# Altium project SCH-29227.PrjPcb (part 1 of 2)
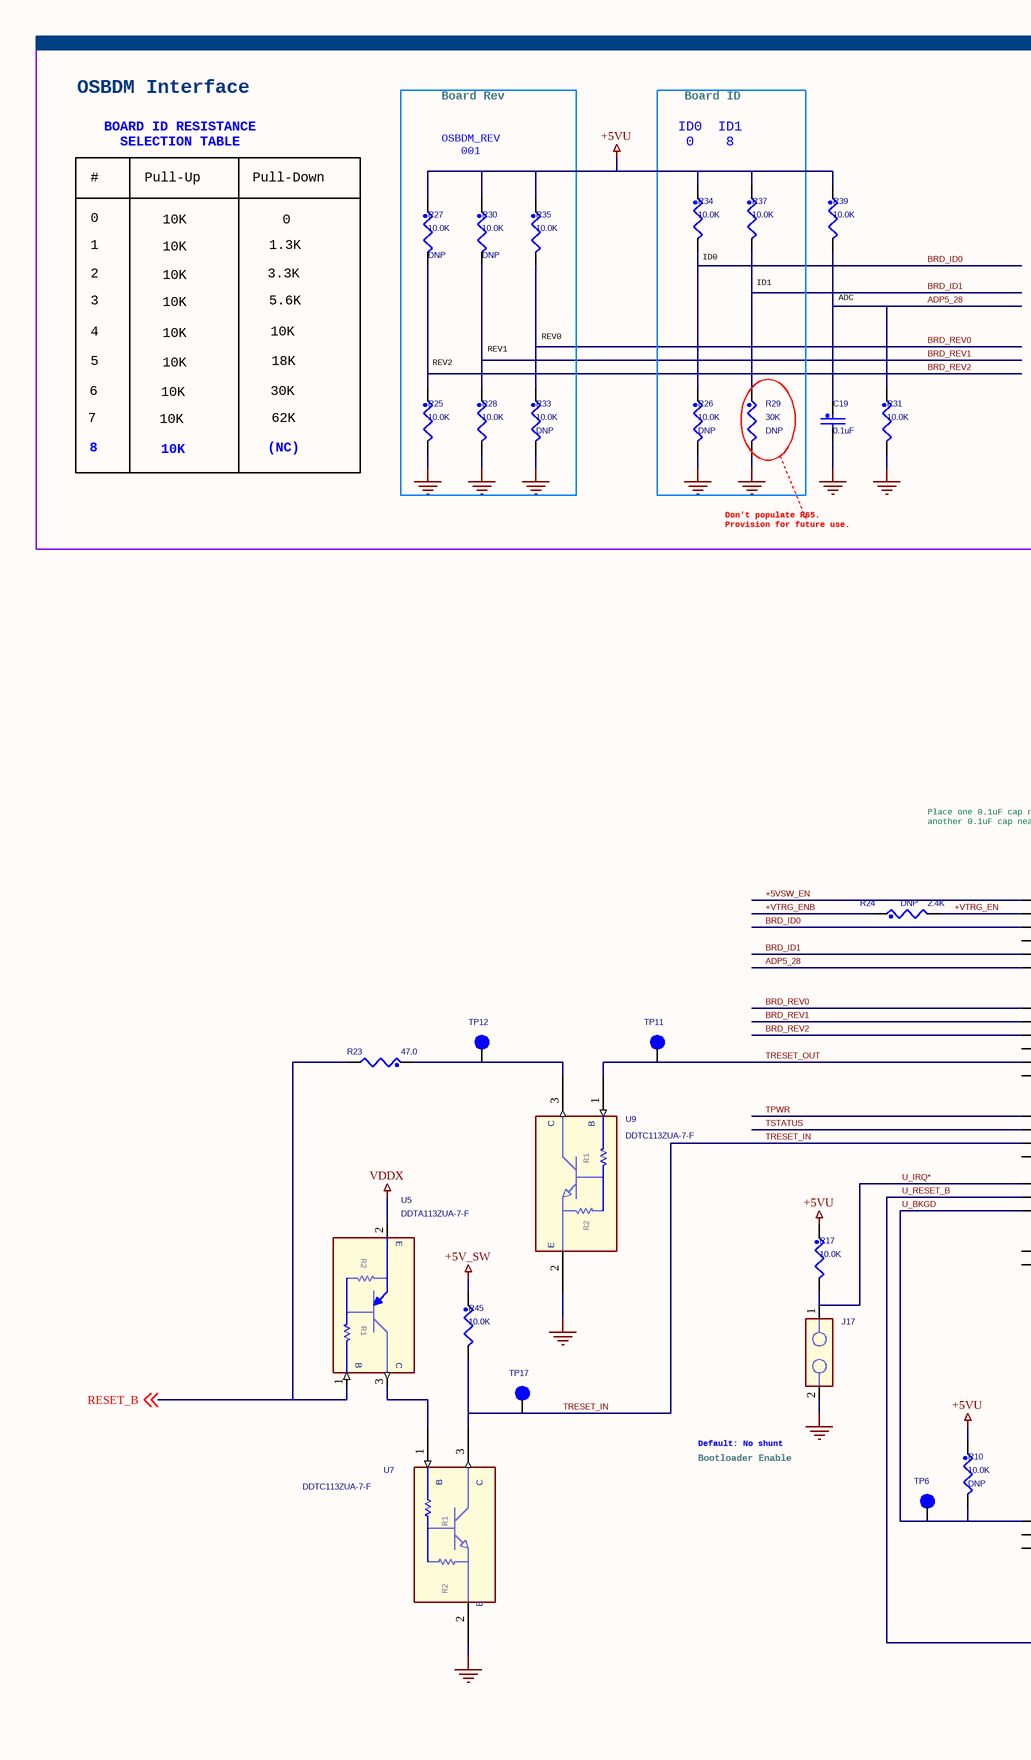
[diagram p0: 06.SchDoc, left]
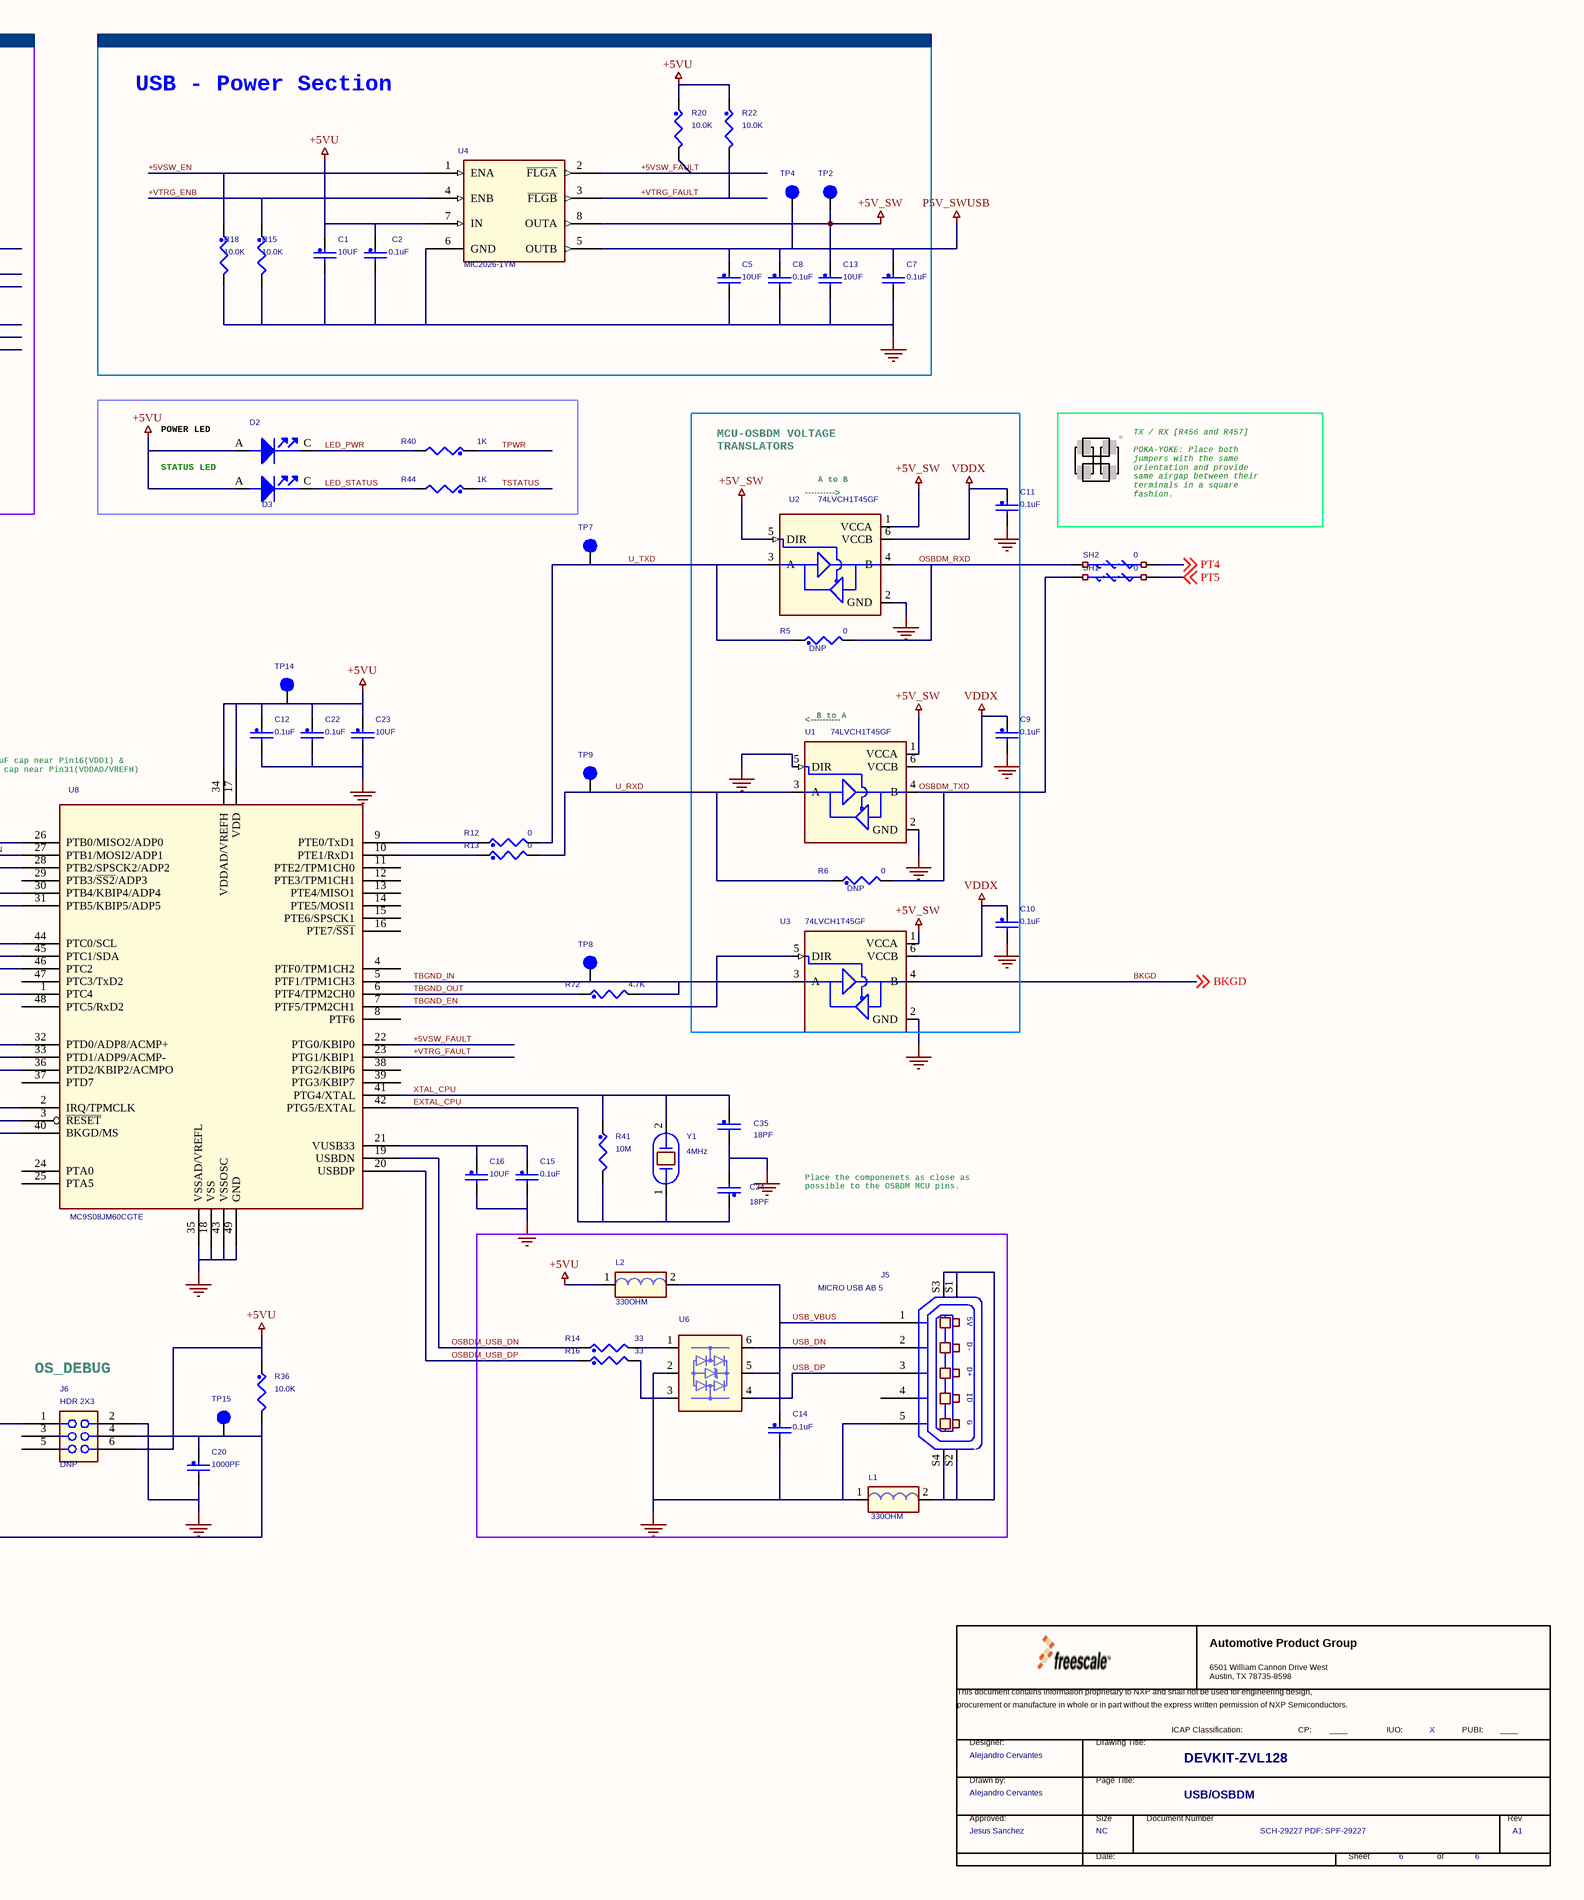
[diagram p1: 06.SchDoc, right]
6 sheets, 246 parts. Net scope: global (net labels, ports and power ports of the same name join across sheets).
Sheets:
  06.SchDoc
  05.SchDoc
  04.SchDoc
  03.SchDoc
  02.SchDoc
  01.SchDoc

## Sheet 06.SchDoc
size 513 x 386 mm

### Parts
(Parts that share a designator on the sheet are numbered #1, #2 ... from top to bottom, then left to right.)
*#1  FCP: ____  FIUO: X  DrawnBy: Alejandro Cervantes  Approver: Jesus Sanchez  PageTitle: USB/OSBDM  Page Count: 6  Page Size: NC  Title: DEVKIT-ZVL128  RevCode: A1  Doc: SCH-29227 PDF: SPF-29227  (hidden comment: TitleBlock_AMPG)  (graphical)
C1  10UF  [CC0805_OV]
C2  0.1uF  [CC0402_25]
C5  10UF  [CC0805_OV]
C7  0.1uF  [CC0402_25]
C8  0.1uF  [CC0402_25]
C9  0.1uF  [CC0402_25]
C10  0.1uF  [CC0402_25]
C11  0.1uF  [CC0402_25]
C12  0.1uF  [CC0402_25]
C13  10UF  [CC0805_OV]
C14  0.1uF  [CC0402_25]
C15  0.1uF  [CC0402_25]
C16  10UF  [CC0805_OV]
C19  0.1uF  [CC0402_25]
C20  1000PF  [CC0402_25]
C22  0.1uF  [CC0402_25]
C23  10UF  [CC0805_OV]
C24  18PF  [CC0402_25]
C35  18PF  [CC0402_25]
D2  LED_YEL  [LED_0603]  (value not drawn)
D3  LED_GREEN  [LED_0603]  (value not drawn)
J5  MICRO USB AB 5  [con5_microusb]
J6  HDR 2X3  ASSY_OPT: DNP  [HDR203]
J17  HDR 1X2 TH  [HDR102]  (value not drawn)
L1  330OHM  [IND_0805]
L2  330OHM  [IND_0805]
R5  0  ASSY_OPT: DNP  [RC0603_OV]
R6  0  ASSY_OPT: DNP  [RC0603_OV]
R10  10.0K  ASSY_OPT: DNP  [RC0402_25]
R12  0  [RC0603_OV]
R13  0  [RC0603_OV]
R14  33  [RC0603_OV]
R15  10.0K  [RC0402_25]
R16  33  [RC0603_OV]
R17  10.0K  [RC0402_25]
R18  10.0K  [RC0402_25]
R20  10.0K  [RC0402_25]
R22  10.0K  [RC0402_25]
R23  47.0  [RC0603_OV]
R24  2.4K  ASSY_OPT: DNP  [RC0603_OV]
R25  10.0K  [RC0402_25]
R26  10.0K  ASSY_OPT: DNP  [RC0402_25]
R27  10.0K  ASSY_OPT: DNP  [RC0402_25]
R28  10.0K  [RC0402_25]
R29  30K  ASSY_OPT: DNP  [RC0402_25]
R30  10.0K  ASSY_OPT: DNP  [RC0402_25]
R31  10.0K  [RC0402_25]
R33  10.0K  ASSY_OPT: DNP  [RC0402_25]
R34  10.0K  [RC0402_25]
R35  10.0K  [RC0402_25]
R36  10.0K  [RC0402_25]
R37  10.0K  [RC0402_25]
R39  10.0K  [RC0402_25]
R40  1K  [RC0603_OV]
R41  10M  [RC0402_25]
R44  1K  [RC0603_OV]
R45  10.0K  [RC0402_25]
R72  4.7K  [RC0402_25]
SH1  0  [SH0603]
SH2  0  [SH0603]
TP2  TPAD_028  [TPAD_028]  (value not drawn)
TP4  TPAD_028  [TPAD_028]  (value not drawn)
TP6  TPAD_028  [TPAD_028]  (value not drawn)
TP7  TPAD_028  [TPAD_028]  (value not drawn)
TP8  TPAD_028  [TPAD_028]  (value not drawn)
TP9  TPAD_028  [TPAD_028]  (value not drawn)
TP11  TPAD_028  [TPAD_028]  (value not drawn)
TP12  TPAD_028  [TPAD_028]  (value not drawn)
TP14  TPAD_028  [TPAD_028]  (value not drawn)
TP15  TPAD_028  [TPAD_028]  (value not drawn)
TP17  TPAD_028  [TPAD_028]  (value not drawn)
U1  74LVCH1T45GF  [sot891_6p_0p35_1p05x1p05]
U2  74LVCH1T45GF  [sot891_6p_0p35_1p05x1p05]
U3  74LVCH1T45GF  [sot891_6p_0p35_1p05x1p05]
U4  MIC2026-1YM  [SO8]
U5  DDTA113ZUA-7-F  [sc70_3]
U6  RClamp0502A.TCT  [SC-89]  (value not drawn)
U7  DDTC113ZUA-7-F  [sc70_3]
U8  MC9S08JM60CGTE  [qfn48_0p5_5p25x5p25_a]
U9  DDTC113ZUA-7-F  [sc70_3]
Y1  4MHz  [HC49SDLF]

### Blocks framed on the sheet
OSBDM Interface: C19 R31 R39
Board Rev: R25 R27 R28 R30 R33 R35
Board ID: R26 R29 R34 R37
USB - Power Section: C1 C2 C5 C7 C8 C13 R15 R18 R20 R22 TP2 TP4 U4

### Nets
+5V_SW: C13.1 R45.1 TP2.1(Pin1) U1.1(VCCA) U2.1(VCCA) U2.5(DIR) U3.1(VCCA) U4.8(OUTA)
+5VU: C1.1 C2.1 C12.1 C22.1 C23.1 D2.A(ANODE) D3.A(ANODE) J6.6(B3) L2.1 R10.1 R17.1 R20.1 R22.1 R27.1 R30.1 R34.1 R35.1 R36.1 R37.1 R39.1 TP14.1(Pin1) U4.7(IN) U8.17(VDD) U8.34(VDDAD/VREFH)
GND: C1.2 C2.2 C5.2 C7.2 C8.2 C9.2 C10.2 C11.2 C12.2 C13.2 C14.2 C15.2 C16.2 C19.2 C20.2 C22.2 C23.2 C24.2 C35.2 J5.5(P5) J6.2(B1) J17.2 L1.1 R15.2 R18.2 R25.2 R26.2 R28.2 R29.2 R31.2 R33.2 U1.2(GND) U1.5(DIR) U2.2(GND) U3.2(GND) U4.6(GND) U6.2(GND) U7.2(E) U8.18(VSS) U8.35(VSSAD/VREFL) U8.43(VSSOSC) U8.49(GND) U9.2(E)
P5V_SWUSB: C5.1 C7.1 C8.1 TP4.1(Pin1) U4.5(OUTB)
VDDX: C9.1 C10.1 C11.1 U1.6(VCCB) U2.6(VCCB) U3.6(VCCB) U5.2(E)
+5VSW_EN: R18.1 U4.1(ENA) U8.26(PTB0/MISO2/ADP0)
+5VSW_FAULT: R20.2 U4.2(~{FLGA}) U8.22(PTG0/KBIP0)
+VTRG_EN: R24.2 U8.27(PTB1/MOSI2/ADP1)
+VTRG_ENB: R15.1 R24.1 U4.4(ENB)
+VTRG_FAULT: R22.2 U4.3(~{FLGB}) U8.23(PTG1/KBIP1)
ADP5_28: C19.1 R31.1 R39.2 U8.31(PTB5/KBIP5/ADP5)
BKGD: U3.4(B) ; off-sheet BKGD
BRD_ID0: R26.1 R34.2 U8.28(PTB2/SPSCK2/ADP2)
BRD_ID1: R29.1 R37.2 U8.30(PTB4/KBIP4/ADP4)
BRD_REV0: R33.1 R35.2 U8.44(PTC0/SCL)
BRD_REV1: R28.1 R30.2 U8.45(PTC1/SDA)
BRD_REV2: R25.1 R27.2 U8.46(PTC2)
EXTAL_CPU: C24.1 R41.2 U8.42(PTG5/EXTAL) Y1.1
LED_PWR: D2.C(CATHODE) R40.2
LED_STATUS: D3.C(CATHODE) R44.2
OSBDM_RXD: R5.2 SH2.1 U2.4(B)
OSBDM_TXD: R6.2 SH1.1 U1.4(B)
OSBDM_USB_DN: R14.1 U8.19(USBDN)
OSBDM_USB_DP: R16.1 U8.20(USBDP)
PT4: SH2.2 ; off-sheet PT4
PT5: SH1.2 ; off-sheet PT5
RESET_B: R23.2 U5.1(B) ; off-sheet RESET_B
TBGND_EN: U3.5(DIR) U8.7(PTF5/TPM2CH1)
TBGND_IN: R72.2 TP8.1(Pin1) U3.3(A) U8.5(PTF1/TPM1CH3)
TBGND_OUT: R72.1 U8.6(PTF4/TPM2CH0)
TPWR: R40.1 U8.32(PTD0/ADP8/ACMP+)
TRESET_IN: R45.2 TP17.1(Pin1) U7.3(C) U8.36(PTD2/KBIP2/ACMPO)
TRESET_OUT: TP11.1(Pin1) U8.1(PTC4) U9.1(B)
TSTATUS: R44.1 U8.33(PTD1/ADP9/ACMP-)
U_BKGD: J6.1(A1) R10.2 TP6.1(Pin1) U8.40(BKGD/MS)
U_IRQ*: J17.1 R17.2 U8.2(IRQ/TPMCLK)
U_RESET_B: C20.1 J6.4(B2) R36.2 TP15.1(Pin1) U8.3(~{RESET})
U_RXD: R6.1 R13.2 TP9.1(Pin1) U1.3(A)
U_TXD: R5.1 R12.2 TP7.1(Pin1) U2.3(A)
USB_DN: J5.2(P2) U6.6(D+)
USB_DP: J5.3(P3) U6.4(D-)
USB_VBUS: C14.1 J5.1(P1) L2.2 U6.5(VCC)
XTAL_CPU: C35.1 R41.1 U8.41(PTG4/XTAL) Y1.2
NetC15_1: C15.1 C16.1 U8.21(VUSB33)
NetJ5_S1: J5.S1(SHLD1) J5.S2(SHLD2) J5.S3(SHLD3) J5.S4(SHLD4) L1.2
NetR12_1: R12.1 U8.9(PTE0/TxD1)
NetR13_1: R13.1 U8.10(PTE1/RxD1)
NetR14_2: R14.2 U6.1(D+_PC)
NetR16_2: R16.2 U6.3(D-_PC)
NetR23_1: R23.1 TP12.1(Pin1) U9.3(C)
NetU5_3: U5.3(C) U7.1(B)

Not connected (* = marked no-connect by the designer): J5 4(P4); J6 3(A2) 5(A3); U8 4(PTF0/TPM1CH2) 8(PTF6) 11(PTE2/TPM1CH0) 12(PTE3/TPM1CH1) 13(PTE4/MISO1) 14(PTE5/MOSI1) 15(PTE6/SPSCK1) 16(PTE7/~{SS1}) 24(PTA0) 25(PTA5) 29(PTB3/~{SS2}/ADP3) 37(PTD7) 38(PTG2/KBIP6) 39(PTG3/KBIP7) 47(PTC3/TxD2) 48(PTC5/RxD2)

### Notes on the sheet
- BOARD ID RESISTANCE
  SELECTION TABLE
- OSBDM_REV
  001
- ID0  ID1
  0    8
- #
- Pull-Up
- Pull-Down
- 1
- 2
- 0
- 10K
- 3.3K
- 1.3K
- (near R34) ID0
- 3
- 4
- 5.6K
- REV0
- (near R37) ID1
- ADC
- 6
- 5
- 30K
- 18K
- REV2
- REV1
- 7
- 8
- (NC)
- 62K
- POWER LED
- MCU-OSBDM VOLTAGE
  TRANSLATORS
- TX / RX [R456 and R457]
  POKA-YOKE: Place both
  jumpers with the same
  orientation and provide
  same airgap between their
  terminals in a square
  fashion.
- Don't populate R65.
  Provision for future use.
- STATUS LED
- (near U2) ---------->
- (near U2) A to B
- (near U8) Place one 0.1uF cap near Pin16(VDD1) &
  another 0.1uF cap near Pin31(VDDAD/VREFH)
- (near U1) <----------
- (near U1) B to A
- Place the componenets as close as
  possible to the OSBDM MCU pins.
- Default: No shunt
- Bootloader Enable
- OS_DEBUG
- (in symbol DDTA113ZCA_3P) R2; R1
- (in symbol DDTD122LC) R1; R2
- (in symbol TitleBlock_AMPG) Automotive Product Group; 6501 William Cannon Drive West / Austin, TX 78735-8598; This document contains information proprietary to NXP and shall not be used for engineering design,; procurement or manufacture in whole or in part without the express written permission of NXP Semiconductors.; ICAP Classification:; CP:; IUO:; PUBI:; Designer:; Drawing Title:; Drawn by:; Page Title:; Approved:; Size; Document Number; Rev; Date:; Sheet; of
- (in symbol USB_MINI_AB_RECEPTACLE) 5V; D-; D+; ID; G

### Library data of the parts
*#1 = TitleBlock_AMPG: OrgAddr2: Austin, TX 78735-8598; OrgAddr1: 6501 William Cannon Drive West; OrgName: Freescale Semiconductor; PUBI: ____; Designer: Alejandro Cervantes; Page Number: 6; Page Create Date: March  8, 1995
C1 C16 = CAP_NP: CAP CER 10UF 10V 10% X7R 0805; CLASS: DISCRETE; FPLIST: CC0805_OV,CC0805,0805_CC; CAD_APPROVED: Yes; MFG_PN01: GRM21BR71A106KE51L; MFG_NAME01: Murata; AGILE_PN: 150-78501; VOLTAGE: 10V; HEIGHT: 1.4MM; ROHS: Yes; Tolerance: 10%
C2 C7 C8 C15 C22 = CAP_NP: CAP CER 0.1uF 50V 10% X7R 0402; CLASS: DISCRETE; FPLIST: CC0402_25,CC0402_HD,0402_CC; CAD_APPROVED: Yes; MFG_PN01: GRM155R71H104KE14D; MFG_NAME01: MURATA; AGILE_PN: 150-79069; HEIGHT: 0.55MM; ROHS: Yes; Tolerance: 10%; TOL: 10%; VOLTAGE: 50V
C5 C13 C23 = CAP_NP: CAP CER 10UF 10V 10% X7R 0805; CLASS: DISCRETE; AGILE_PN: 150-78501; MFG_NAME01: Murata; MFG_PN01: GRM21BR71A106KE51L; CAD_APPROVED: Yes; FPLIST: CC0805_OV,CC0805,0805_CC; Tolerance: 10%; ROHS: Yes; HEIGHT: 1.4MM; VOLTAGE: 10V
C9-C12 C14 C19 = CAP_NP: CAP CER 0.1uF 50V 10% X7R 0402; CLASS: DISCRETE; AGILE_PN: 150-79069; MFG_NAME01: MURATA; MFG_PN01: GRM155R71H104KE14D; CAD_APPROVED: Yes; FPLIST: CC0402_25,CC0402_HD,0402_CC; VOLTAGE: 50V; Tolerance: 10%; ROHS: Yes; HEIGHT: 0.55MM
  C12 C14 C19: TOL: 10%
C20 = CAP_NP: CAP CER 1000PF 50V 10% X7R 0402; CLASS: DISCRETE; VOLTAGE: 50VDC; TOL: 5%; FPLIST: CC0402_25,CC0402_HD,0402_CC; CAD_APPROVED: Yes; MFG_PN01: 04025C102KAT2A; MFG_NAME01: AVX; Tolerance: +10%; AGILE_PN: 150-75271; HEIGHT: 0.635 MM; ROHS: Yes
C24 C35 = CAP_NP: CAP CER 18PF 50V 1% C0G 0402; CLASS: DISCRETE; FPLIST: CC0402_25,CC0402_HD,0402_CC; CAD_APPROVED: Yes; MFG_PN01: 04025A180FAT2A; MFG_NAME01: AVX; AGILE_PN: 150-76630; VOLTAGE: 50V; HEIGHT: 0.59MM; ROHS: Yes; Tolerance: 1%
D2 = LED: LED YEL SGL 25MA 0603; CLASS: IC; CAD_APPROVED: Yes; MFG_PN01: 598-8040-107F; MFG_NAME01: DIALIGHT; AGILE_PN: 370-76522; HEIGHT: 0.8MM; ROHS: Yes
D3 = LED: LED ULTRA-BRIGHT GREEN SMT 0603; CLASS: IC; AGILE_PN: 370-75077; MFG_NAME01: LITE ON; MFG_PN01: LTST-C190KGKT; CAD_APPROVED: YES; ROHS: Yes; HEIGHT: 0.8MM
J5 = USB_MINI_AB_RECEPTACLE: CON 1X5 USB_MICRO_AB_RECEPTACLE RA SMT 0.65MM SP 105H AU; CLASS: IO; AGILE_PN: 211-78722; MFG_NAME01: Molex; MFG_PN01: 47589-0001; CAD_APPROVED: Yes; ROHS: Yes; HEIGHT: 2.65MM
J6 = CONN_HDR_3X2: HDR 2X3 TH 100MIL CTR 335H AU 95L; CLASS: IO; CAD_APPROVED: Yes; MFG_PN01: TSW-103-07-S-D; MFG_NAME01: SAMTEC; AGILE_PN: 210-75698; PRIORITY_PN: 028-00560; VOLTAGE: 450-550VAC; HEIGHT: 8.5MM; ROHS: Yes
J17 = JUMPER_0: HDR 1X2 TH 100MIL SP 339H AU 98L; CLASS: IO; CAD_APPROVED: YES; MFG_PN01: TSW-102-07-G-S; MFG_NAME01: SAMTEC; AGILE_PN: 210-80468; PRIORITY_PN: 028-00556; HEIGHT: 8.71 MM; ROHS: Yes
L1 = BEAD: IND FER BEAD 330 OHM@100MHZ 1.5A 25% 0805; PART_TYPE: FERRITE\BEAD; CLASS: DISCRETE; PRIORITY_PN: 024-00202; CAD_APPROVED: Yes; MFG_PN01: BLM21PG331SN1D; MFG_NAME01: MURATA; AGILE_PN: 180-77691; HEIGHT: 1.05MM; ROHS: Yes; Tolerance: 25%; TOL: 25%
L2 = BEAD: IND FER BEAD 330 OHM@100MHZ 1.5A 25% 0805; PART_TYPE: FERRITE\BEAD; CLASS: DISCRETE; AGILE_PN: 180-77691; MFG_NAME01: MURATA; MFG_PN01: BLM21PG331SN1D; CAD_APPROVED: Yes; PRIORITY_PN: 024-00202; TOL: 25%; Tolerance: 25%; ROHS: Yes; HEIGHT: 1.05MM
R5 = RES: RES MF ZERO OHM 1/10W -- AEC-Q200 0603; CLASS: DISCRETE; AGILE_PN: 470-75407; Tolerance: 1%; MFG_NAME01: KOA SPEER; MFG_PN01: RK73Z1JTTD; CAD_APPROVED: Yes; FPLIST: RC0603_OV,RC0603,R603-X2,0603_CC; PRIORITY_PN: 006-00371; ROHS: Yes; VOLTAGE: 1/10W; HEIGHT: 0.6MM
R6 R12 R13 = RES: RES MF ZERO OHM 1/10W -- AEC-Q200 0603; CLASS: DISCRETE; PRIORITY_PN: 006-00371; AGILE_PN: 470-75407; Tolerance: 1%; MFG_NAME01: KOA SPEER; MFG_PN01: RK73Z1JTTD; CAD_APPROVED: Yes; FPLIST: RC0603_OV,RC0603,R603-X2,0603_CC; VOLTAGE: 1/10W; ROHS: Yes; HEIGHT: 0.6MM
R10 R17 R25-R28 R30 R31 R33-R37 R39 R45 = RES: RES MF 10.0K 1/16W 1% AEC-Q200 0402; CLASS: DISCRETE; AGILE_PN: 470-75416; MFG_NAME01: KOA SPEER; MFG_PN01: RK73H1ETTP1002F; CAD_APPROVED: Yes; FPLIST: RC0402_25,RC0402_HD,0402_CC; Tolerance: 1%; ROHS: Yes; HEIGHT: 0.4MM
R14 = RES: RES MF 33 OHM 1/10W 5% AEC-Q200 0603; CLASS: DISCRETE; FPLIST: RC0603_OV,RC0603,0603_CC; CAD_APPROVED: Yes; MFG_PN01: CRCW060333R0JNEA; MFG_NAME01: VISHAY INTERTECHNOLOGY; AGILE_PN: 470-75848; ROHS: Yes; Tolerance: 5%; TOL: 5%; HEIGHT: 0.55 MM
R15 R18 = RES: RES MF 10.0K 1/16W 1% AEC-Q200 0402; CLASS: DISCRETE; FPLIST: RC0402_25,RC0402_HD,0402_CC; CAD_APPROVED: Yes; MFG_PN01: RK73H1ETTP1002F; MFG_NAME01: KOA SPEER; AGILE_PN: 470-75416; HEIGHT: 0.4MM; ROHS: Yes; Tolerance: 1%
R16 = RES: RES MF 33 OHM 1/10W 5% AEC-Q200 0603; CLASS: DISCRETE; AGILE_PN: 470-75848; MFG_NAME01: VISHAY INTERTECHNOLOGY; MFG_PN01: CRCW060333R0JNEA; CAD_APPROVED: Yes; FPLIST: RC0603_OV,RC0603,0603_CC; HEIGHT: 0.55 MM; TOL: 5%; Tolerance: 5%; ROHS: Yes
R20 = RES: RES MF 10.0K 1/16W 1% AEC-Q200 0402; CLASS: DISCRETE; FPLIST: RC0402_25,RC0402_HD,0402_CC; CAD_APPROVED: Yes; ASSY_OPT: DNP; MFG_PN01: RK73H1ETTP1002F; MFG_NAME01: KOA SPEER; AGILE_PN: 470-75416; HEIGHT: 0.4MM; ROHS: Yes; Tolerance: 1%
R22 = RES: RES MF 10.0K 1/16W 1% AEC-Q200 0402; CLASS: DISCRETE; AGILE_PN: 470-75416; MFG_NAME01: KOA SPEER; MFG_PN01: RK73H1ETTP1002F; ASSY_OPT: DNP; CAD_APPROVED: Yes; FPLIST: RC0402_25,RC0402_HD,0402_CC; Tolerance: 1%; ROHS: Yes; HEIGHT: 0.4MM
R23 = RES: RES MF 47.0 OHM 1/10W 1% 0603; CLASS: DISCRETE; FPLIST: RC0603_OV,RC0603,0603_CC; CAD_APPROVED: Yes; MFG_PN01: RK73H1JTTD47R0F; MFG_NAME01: KOA SPEER; AGILE_PN: 470-75816; PRIORITY_PN: 006-00488; ROHS: Yes; Tolerance: 1%; TOL: 1%; HEIGHT: 0.55 MM
R24 = RES: RES MF 2.40K 1/10W 1% 0603; CLASS: DISCRETE; FPLIST: RC0603_OV,RC0603,0603_CC; CAD_APPROVED: Yes; MFG_PN01: RK73H1JTTD2401F; MFG_NAME01: KOA SPEER; AGILE_PN: 470-30476; PRIORITY_PN: 006-01136; ROHS: Yes; Tolerance: 1%; TOL: 1%; HEIGHT: 0.55 MM
R29 = RES: RES MF 30K  1/16W 1% 0402; CLASS: DISCRETE; FPLIST: RC0402_25,RC0402_HD,0402_CC; CAD_APPROVED: Yes; MFG_PN01: RK73H1ETTP3002F; MFG_NAME01: KOA SPEER; AGILE_PN: 470-30999; HEIGHT: 0.40 MM; ROHS: Yes; Tolerance: 1%
R40 = RES: RES MF 1.0K 1/10W 5% 0603; CLASS: DISCRETE; FPLIST: RC0603_OV,RC0603,0603_CC; CAD_APPROVED: YES; MFG_PN01: CR0603-10W-102JT; MFG_NAME01: VENKEL COMPANY; AGILE_PN: 470-75412; HEIGHT: 0.6MM; TOL: 5%; ROHS: Yes; Tolerance: 5%
R41 = RES: RES MF 10M  1/16W 1% 0402; CLASS: DISCRETE; FPLIST: RC0402_25,RC0402_HD,0402_CC; CAD_APPROVED: Yes; MFG_PN01: RK73H1ETTP1005F; MFG_NAME01: KOA SPEER; AGILE_PN: 470-31288; ROHS: Yes; Tolerance: 1%; HEIGHT: 0.40 MM
R44 = RES: RES MF 1.0K 1/10W 5% 0603; CLASS: DISCRETE; AGILE_PN: 470-75412; MFG_NAME01: VENKEL COMPANY; MFG_PN01: CR0603-10W-102JT; CAD_APPROVED: YES; FPLIST: RC0603_OV,RC0603,0603_CC; HEIGHT: 0.6MM; TOL: 5%; Tolerance: 5%; ROHS: Yes
R72 = RES: RES MF 4.7K 1/16W 5% 0402; CLASS: DISCRETE; FPLIST: RC0402_25,RC0402_HD,0402_CC; CAD_APPROVED: Yes; MFG_PN01: RK73B1ETTP472J; MFG_NAME01: KOA SPEER; AGILE_PN: 470-75626; HEIGHT: 0.41mm; ROHS: Yes; Tolerance: 5%
SH1 SH2 = RES_SHORT-2: ZERO OHM CUT TRACE 0603 PADS; NO PART TO ORDER; CLASS: DISCRETE; AGILE_PN: 470-80018; MFG_NAME01: LAYOUT ELEMENT ONLY; CAD_APPROVED: Yes; FPLIST: SH0603,SH0603_CC,SH0603-X2_PIN1TO2,SH0603-X2_PIN2TO3; MFG_PN01: LAYOUT ELEMENT ONLY; ROHS: Yes; HEIGHT: 0.1MM
TP2 TP4 = TestLoop: TEST POINT PAD 28MIL DIA SMT, NO PART TO ORDER; CLASS: IO; CAD_APPROVED: Yes; AGILE_PN: 211-79313; HEIGHT: 0.1 MM; ROHS: Yes; MFG_PN01: N/A; MFG_NAME01: N/A
TP6-TP9 TP11 TP12 TP14 TP15 TP17 = TestLoop: TEST POINT PAD 28MIL DIA SMT, NO PART TO ORDER; CLASS: IO; AGILE_PN: 211-79313; CAD_APPROVED: Yes; MFG_NAME01: N/A; MFG_PN01: N/A; ROHS: Yes; HEIGHT: 0.1 MM
U1 U2 = 74LVCH1T45_0: IC XCVR 1BIT 3-STATE DUAL 1.2-5.5V SOT891; AGILE_PN: 312-80895; MFG_NAME01: NXP Semiconductors; MFG_PN01: 74LVCH1T45GF,132; CAD_APPROVED: Yes; CLASS: IC; ROHS: Yes; HEIGHT: 0.5MM
U3 = 74LVCH1T45_0: IC XCVR 1BIT 3-STATE DUAL 1.2-5.5V SOT891; CAD_APPROVED: Yes; MFG_PN01: 74LVCH1T45GF,132; MFG_NAME01: NXP Semiconductors; AGILE_PN: 312-80895; CLASS: IC; HEIGHT: 0.5MM; ROHS: Yes
U4 = MIC2526_8P: IC LIN SW PWR ACTIVE HIGH DUAL 2.7V-5.5V 0.5A SOIC8; CAD_APPROVED: Yes; MFG_NAME01: MICREL; AGILE_PN: 312-75936; PRIORITY_PN: 051-MIC20261YM; VOLTAGE: 2.7-5.5V; CLASS: IC; HEIGHT: 1.73mm; ROHS: Yes; MFG_PN01: MIC2026-1YM
U5 = DDTA113ZCA_3P: TRAN PNP PRE-BIASED 100MA 50V SOT-323; CLASS: IC; CAD_APPROVED: Yes; MFG_NAME01: DIODES INC; AGILE_PN: 480-78942; HEIGHT: 1.1MM; ROHS: Yes; MFG_PN01: DDTA113ZUA-7-F
U6 = RClamp0502A_6P: IC TVS ARRAY LOW CAP 3A 5V SOT666; CAD_APPROVED: Yes; MFG_NAME01: SEMTECH CORP; AGILE_PN: 312-80272; CLASS: IC; HEIGHT: 0.6MM; ROHS: Yes; MFG_PN01: RClamp0502A.TCT
U7 U9 = DDTD122LC: TRAN NPN PRE-BIASED 100MA 50V SOT-323; CLASS: IC; AGILE_PN: 480-78940; MFG_NAME01: DIODES INC; CAD_APPROVED: Yes; MFG_PN01: DDTC113ZUA-7-F; ROHS: Yes; HEIGHT: 1.1MM
U8 = MC9S08JM60CGT_4: IC MCU 8BIT 48MHZ 60KB FLASH 2.7-5.5V QFN48; AGILE_PN: 312-78039; MFG_NAME01: FREESCALE SEMICONDUCTOR; CAD_APPROVED: Yes; CLASS: IC; MFG_PN01: MC9S08JM60CGTE; ROHS: Yes; HEIGHT: 1.00MM
Y1 = XTAL: XTAL 4MHZ -- 18PF 20PPM SMT; CLASS: IC; CAD_APPROVED: Yes; MFG_PN01: ABLS-4.000MHZ-B2-T; MFG_NAME01: ABRACON CORP; AGILE_PN: 230-77689; PRIORITY_PN: 048-00299; HEIGHT: 4.2MM; ROHS: Yes

## Sheet 05.SchDoc
size 386 x 246 mm
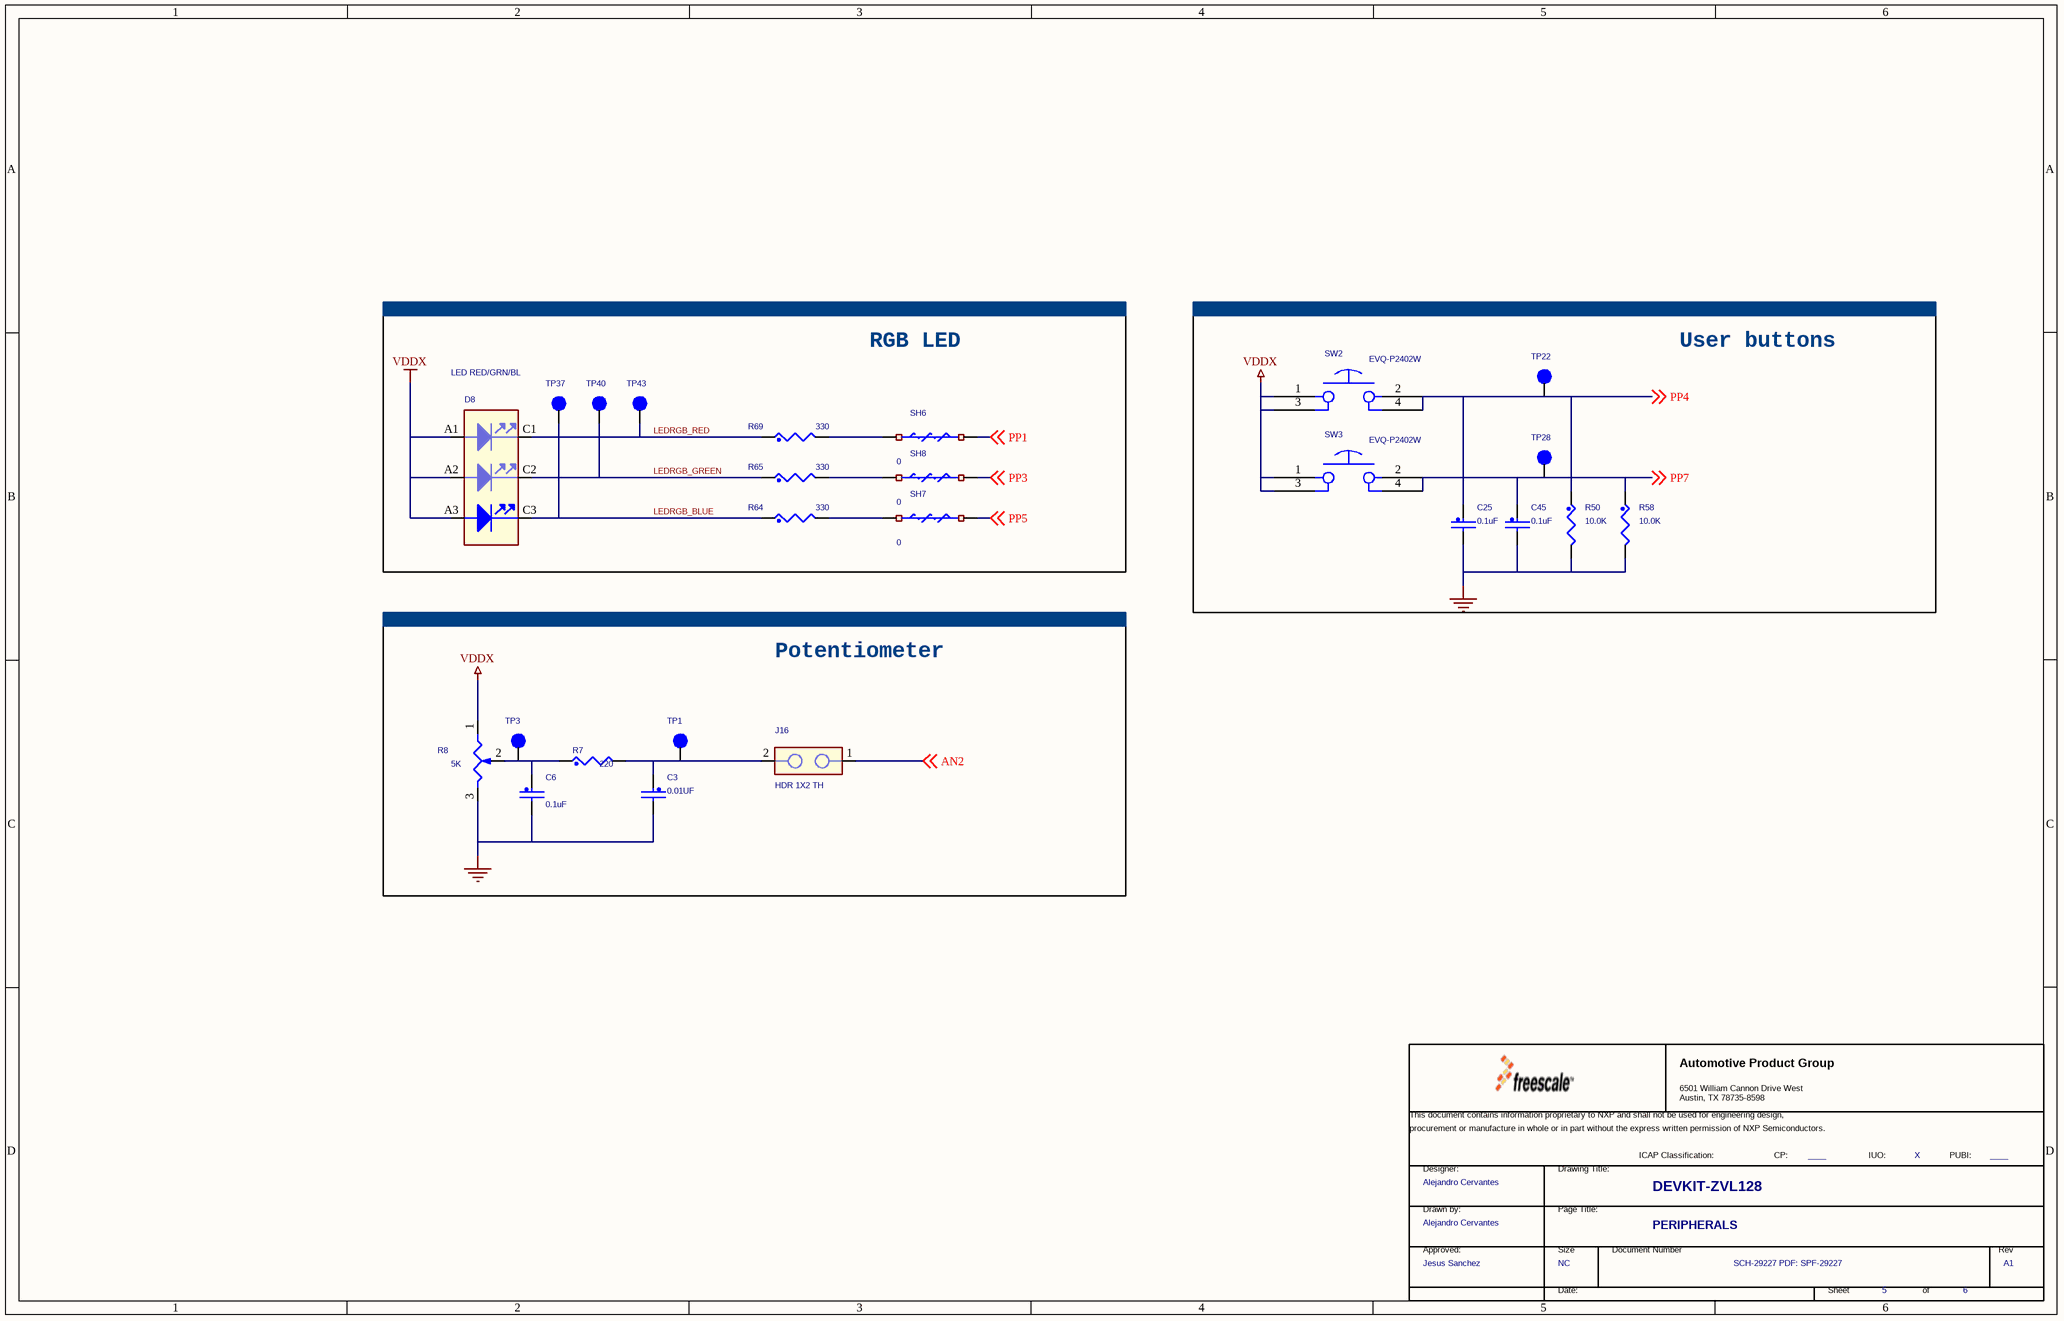
[diagram p2: 05.SchDoc]

### Parts
(Parts that share a designator on the sheet are numbered #1, #2 ... from top to bottom, then left to right.)
*#2  FCP: ____  FIUO: X  DrawnBy: Alejandro Cervantes  Approver: Jesus Sanchez  PageTitle: PERIPHERALS  Page Count: 6  Page Number: 5  Page Size: NC  Title: DEVKIT-ZVL128  RevCode: A1  Doc: SCH-29227 PDF: SPF-29227  (hidden comment: TitleBlock_AMPG)  (graphical)
C3  0.01UF  [CC0402_25]
C6  0.1uF  [CC0402_25]
C25  0.1uF  [CC0402_25]
C45  0.1uF  [CC0402_25]
D8  LED RED/GRN/BL  [led6_5x6mm]
J16  HDR 1X2 TH  [HDR102]
R7  220  [RC0603_OV]
R8  5K  [pot3_3352t]
R50  10.0K  [RC0402_25]
R58  10.0K  [RC0402_25]
R64  330  [RC0603_OV]
R65  330  [RC0603_OV]
R69  330  [RC0603_OV]
SH6  0  [SH0603]
SH7  0  [SH0603]
SH8  0  [SH0603]
SW2  EVQ-P2402W  [sw4_spst_4p8X3p6_2p5]
SW3  EVQ-P2402W  [sw4_spst_4p8X3p6_2p5]
TP1  TPAD_028  [TPAD_028]  (value not drawn)
TP3  TPAD_028  [TPAD_028]  (value not drawn)
TP22  TPAD_028  [TPAD_028]  (value not drawn)
TP28  TPAD_028  [TPAD_028]  (value not drawn)
TP37  TPAD_028  [TPAD_028]  (value not drawn)
TP40  TPAD_028  [TPAD_028]  (value not drawn)
TP43  TPAD_028  [TPAD_028]  (value not drawn)

### Blocks framed on the sheet
User buttons: C25 C45 R50 R58 SW2 SW3 TP22 TP28
RGB LED: D8 R64 R65 R69 SH6-SH8 TP37 TP40 TP43
Potentiometer: C3 C6 J16 R7 R8 TP1 TP3

### Nets
GND: C3.2 C6.2 C25.2 C45.2 R8.3(B) R50.2 R58.2
VDDX: D8.A1(ANODE1) D8.A2(ANODE2) D8.A3(ANODE3) R8.1(A) SW2.1 SW2.3 SW3.1 SW3.3
AN2: J16.1 ; off-sheet AN2
LEDRGB_BLUE: D8.C3(CATHODE3) R64.1 TP37.1(Pin1)
LEDRGB_GREEN: D8.C2(CATHODE2) R65.1 TP40.1(Pin1)
LEDRGB_RED: D8.C1(CATHODE1) R69.1 TP43.1(Pin1)
PP1: SH6.2 ; off-sheet PP1
PP3: SH8.2 ; off-sheet PP3
PP4: C25.1 R50.1 SW2.2 SW2.4 TP22.1(Pin1) ; off-sheet PP4
PP5: SH7.2 ; off-sheet PP5
PP7: C45.1 R58.1 SW3.2 SW3.4 TP28.1(Pin1) ; off-sheet PP7
NetC3_1: C3.1 J16.2 R7.2 TP1.1(Pin1)
NetC6_1: C6.1 R7.1 R8.2(WIPER) TP3.1(Pin1)
NetR64_2: R64.2 SH7.1
NetR65_2: R65.2 SH8.1
NetR69_2: R69.2 SH6.1

### Notes on the sheet
- (in symbol TitleBlock_AMPG) Automotive Product Group; 6501 William Cannon Drive West / Austin, TX 78735-8598; This document contains information proprietary to NXP and shall not be used for engineering design,; procurement or manufacture in whole or in part without the express written permission of NXP Semiconductors.; ICAP Classification:; CP:; IUO:; PUBI:; Designer:; Drawing Title:; Drawn by:; Page Title:; Approved:; Size; Document Number; Rev; Date:; Sheet; of

### Library data of the parts
*#2 = TitleBlock_AMPG: OrgName: Freescale Semiconductor; OrgAddr1: 6501 William Cannon Drive West; OrgAddr2: Austin, TX 78735-8598; PUBI: ____; Designer: Alejandro Cervantes; Page Create Date: March  8, 1995
C3 = CAP_NP: CAP CER 0.01UF 16V 20% X7R 0402; CLASS: DISCRETE; AGILE_PN: 150-30082; MFG_NAME01: AVX; MFG_PN01: 0402YC103MAT2A; CAD_APPROVED: Yes; FPLIST: CC0402_25,CC0402_HD,0402_CC; TOL: 20%; ROHS: Yes; HEIGHT: 0.56MM; Tolerance: 20%; VOLTAGE: 16V
C6 = CAP_NP: CAP CER 0.1uF 50V 10% X7R 0402; CLASS: DISCRETE; SIGNAL_MODEL: DEFAULT_CAPACITOR_100000pF_2_1; FPLIST: CC0402_25,CC0402_HD,0402_CC; CAD_APPROVED: Yes; MFG_PN01: GRM155R71H104KE14D; MFG_NAME01: MURATA; AGILE_PN: 150-79069; VOLTAGE: 50V; TOL: 10%; HEIGHT: 0.55MM; ROHS: Yes; Tolerance: 10%
C25 C45 = CAP_NP: CAP CER 0.1uF 50V 10% X7R 0402; CLASS: DISCRETE; FPLIST: CC0402_25,CC0402_HD,0402_CC; CAD_APPROVED: Yes; MFG_PN01: GRM155R71H104KE14D; MFG_NAME01: MURATA; AGILE_PN: 150-79069; PRIORITY_PN: 021-00169; SIGNAL_MODEL: DEFAULT_CAPACITOR_100000pF_2_1; HEIGHT: 0.55MM; ROHS: Yes; Tolerance: 10%; VOLTAGE: 50V
D8 = LED_TRI_COLOR: LED RED/GRN/BL SGL 3-IN-1 50mA SMT; CLASS: IC; CAD_APPROVED: Yes; MFG_PN01: CLP6C-FKB-CM1Q1H1BB7R3R3; MFG_NAME01: Cree, Inc; AGILE_PN: 370-76661; HEIGHT: 2.6 MM; ROHS: Yes
J16 = JUMPER_2_2mm: HDR 1X2 TH 100MIL SP 339H AU 98L; CLASS: IO; AGILE_PN: 210-80468; MFG_NAME01: SAMTEC; MFG_PN01: TSW-102-07-G-S; CAD_APPROVED: YES; FPLIST: HDR102,SH_HDR102_BOTTOM; ROHS: Yes; HEIGHT: 8.71 MM
R7 = RES: RES MF 220 OHM 1/10W 5% 0603; CLASS: DISCRETE; AGILE_PN: 470-30297; MFG_NAME01: KOA SPEER; MFG_PN01: RK73B1JTTD221J; CAD_APPROVED: Yes; FPLIST: RC0603_OV,RC0603,0603_CC; HEIGHT: 0.6MM; Tolerance: 5%; ROHS: Yes
R8 = POT: RES POT 5K 1/2W 20% TH; CLASS: DISCRETE; AGILE_PN: 470-80115; MFG_NAME01: BOURNS; MFG_PN01: 3352T-1-502LF; CAD_APPROVED: Yes; HEIGHT: 4.32 MM; TOL: 20%; Tolerance: 20%; ROHS: Yes
R50 R58 = RES: RES MF 10.0K 1/16W 1% AEC-Q200 0402; CLASS: DISCRETE; PRIORITY_PN: 006-00552; AGILE_PN: 470-75416; MFG_NAME01: KOA SPEER; MFG_PN01: RK73H1ETTP1002F; CAD_APPROVED: Yes; FPLIST: RC0402_25,RC0402_HD,0402_CC; SIGNAL_MODEL: DEFAULT_RESISTOR_10000OHM_2_1; Tolerance: 1%; ROHS: Yes; TOL: 1%; HEIGHT: 0.4MM
R64 R65 R69 = RES: RES MF 330 OHM 1/10W 5% 0603; CLASS: DISCRETE; AGILE_PN: 470-80926; MFG_NAME01: YAGEO AMERICA; MFG_PN01: RC0603JR-07330RL; CAD_APPROVED: Yes; FPLIST: RC0603_OV,RC0603,0603_CC; Tolerance: 5%; ROHS: Yes; HEIGHT: 0.55 MM
SH6 SH8 = RES_SHORT-2: ZERO OHM CUT TRACE 0603 PADS; NO PART TO ORDER; CLASS: DISCRETE; AGILE_PN: 470-80018; MFG_NAME01: LAYOUT ELEMENT ONLY; CAD_APPROVED: Yes; FPLIST: SH0603,SH0603_CC,SH0603-X2_PIN1TO2; MFG_PN01: LAYOUT ELEMENT ONLY; ROHS: Yes; HEIGHT: 0.1MM
SH7 = RES_SHORT-2: ZERO OHM CUT TRACE 0603 PADS; NO PART TO ORDER; CLASS: DISCRETE; FPLIST: SH0603,SH0603_CC,SH0603-X2_PIN1TO2; CAD_APPROVED: Yes; MFG_PN01: LAYOUT ELEMENT ONLY; AGILE_PN: 470-80018; HEIGHT: 0.1MM; ROHS: Yes; MFG_NAME01: LAYOUT ELEMENT ONLY
SW2 = EDGE_MOUNT_PB_SW_2: SW SPST PB NO 0.02A 15V SMT; CLASS: IC; CAD_APPROVED: Yes; MFG_NAME01: Panasonic; AGILE_PN: 510-77992; HEIGHT: 2.7 MM; ROHS: Yes; MFG_PN01: EVQ-P2402W
SW3 = EDGE_MOUNT_PB_SW_2: SW SPST PB NO 0.02A 15V SMT; CLASS: IC; AGILE_PN: 510-77992; MFG_NAME01: Panasonic; CAD_APPROVED: Yes; MFG_PN01: EVQ-P2402W; ROHS: Yes; HEIGHT: 2.7 MM
TP1 TP3 TP43 = TestLoop: as TP2 on sheet 06; HEIGHT: 0.1 MM; ROHS: Yes; MFG_PN01: N/A; MFG_NAME01: N/A
TP22 TP28 TP37 TP40 = TestLoop: as TP6 on sheet 06; MFG_NAME01: N/A; MFG_PN01: N/A; ROHS: Yes; HEIGHT: 0.1 MM

## Sheet 04.SchDoc
size 817 x 513 mm
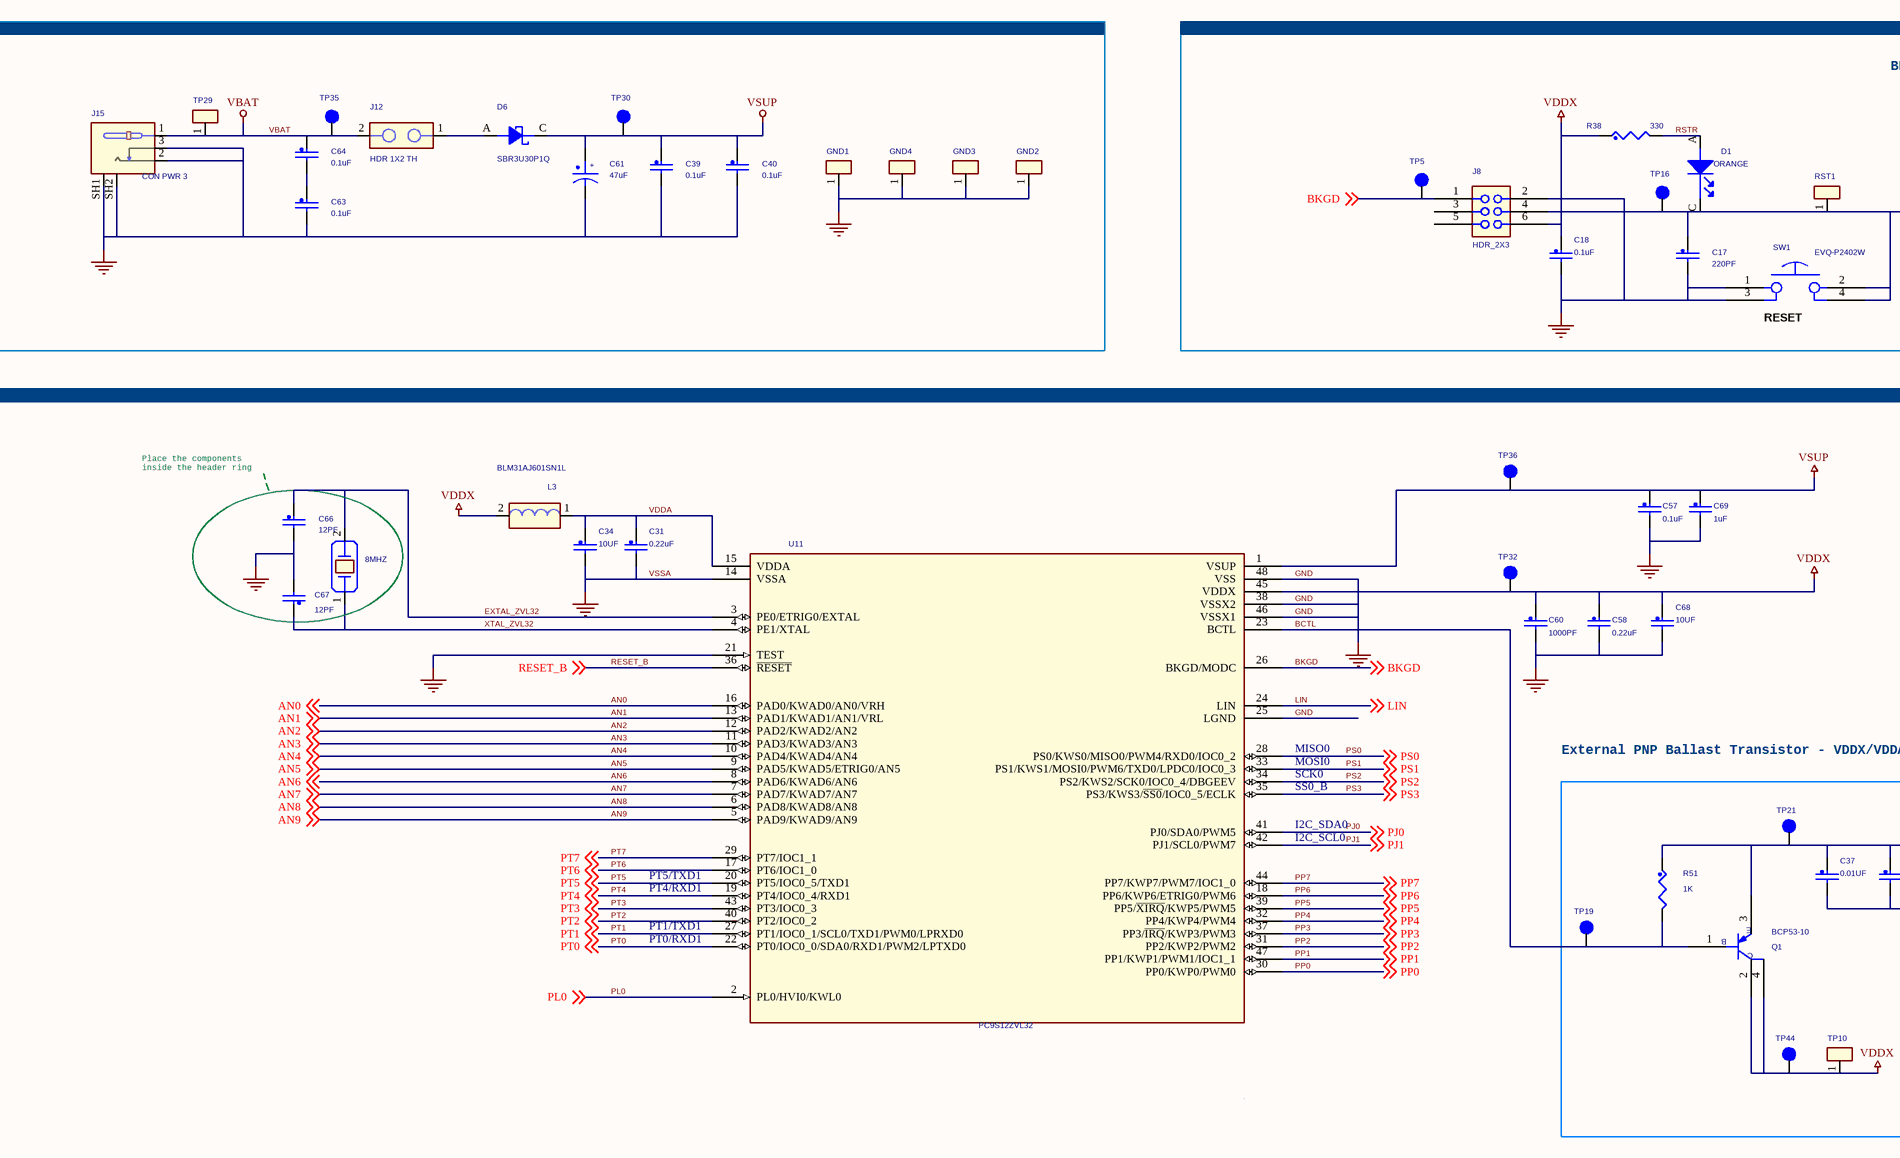
[diagram p3: 04.SchDoc, top left]
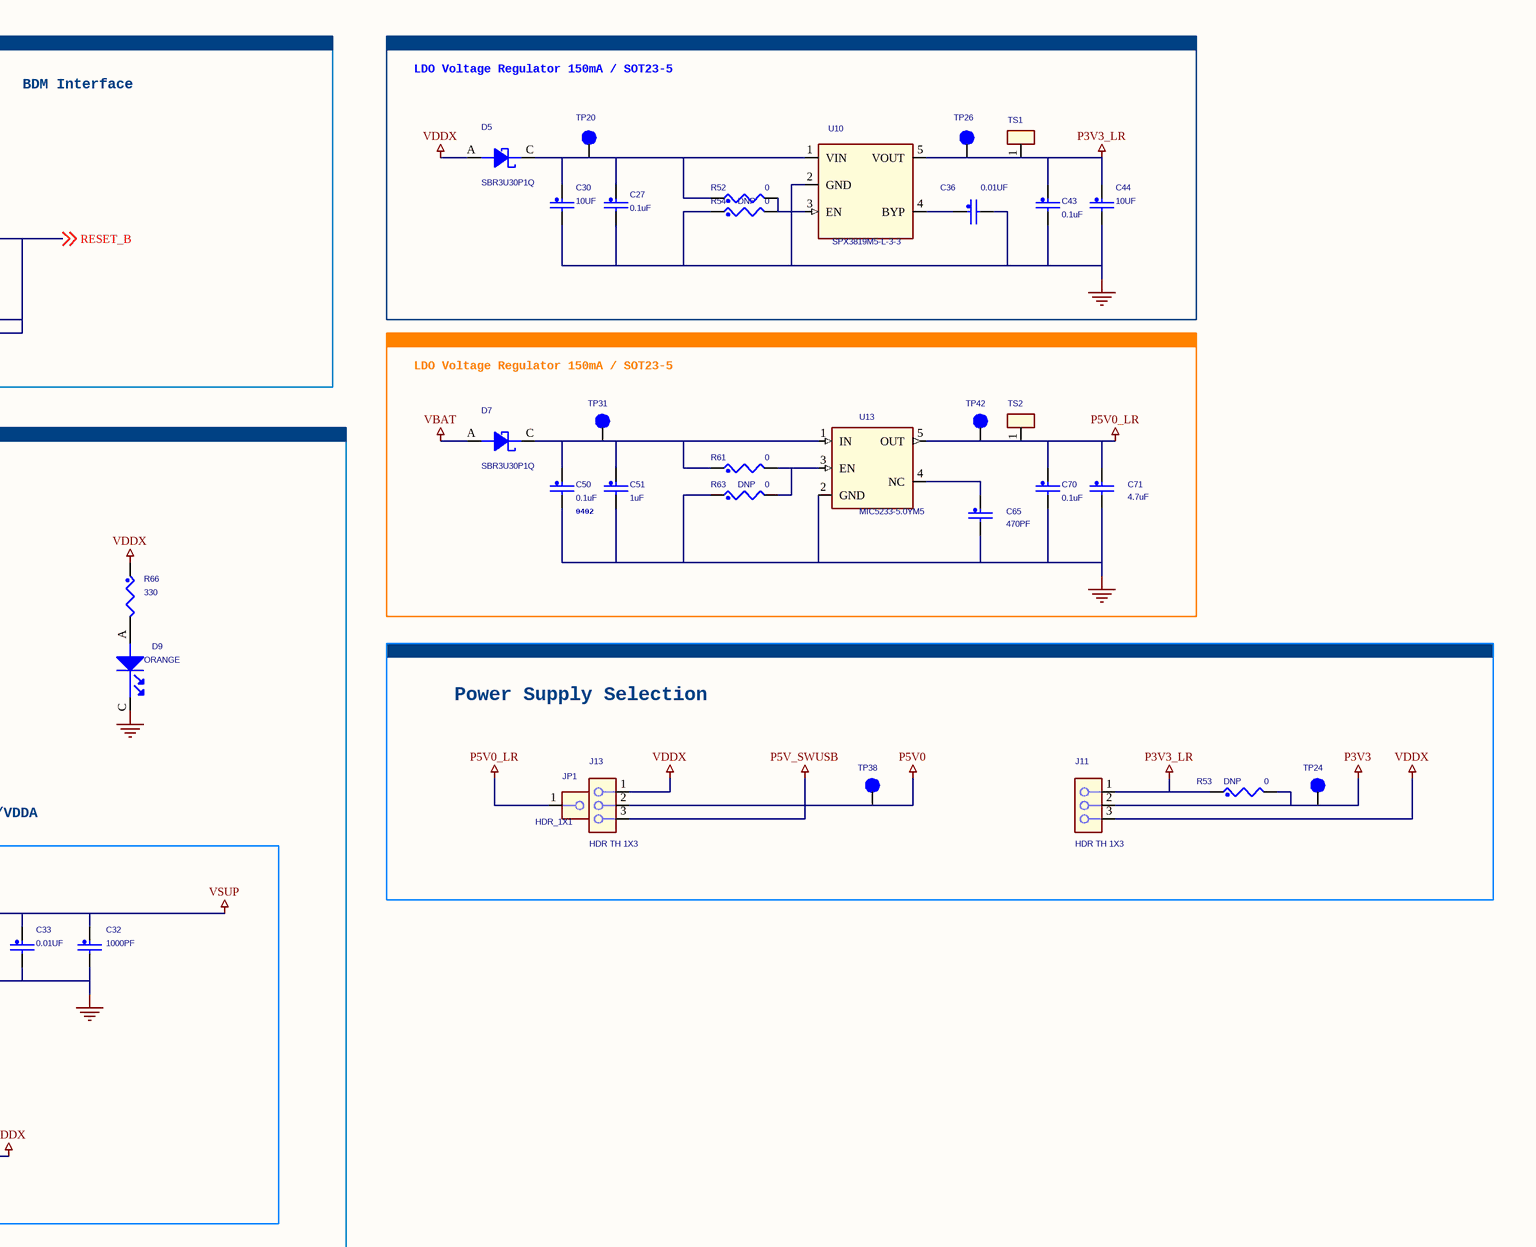
[diagram p4: 04.SchDoc, top right]
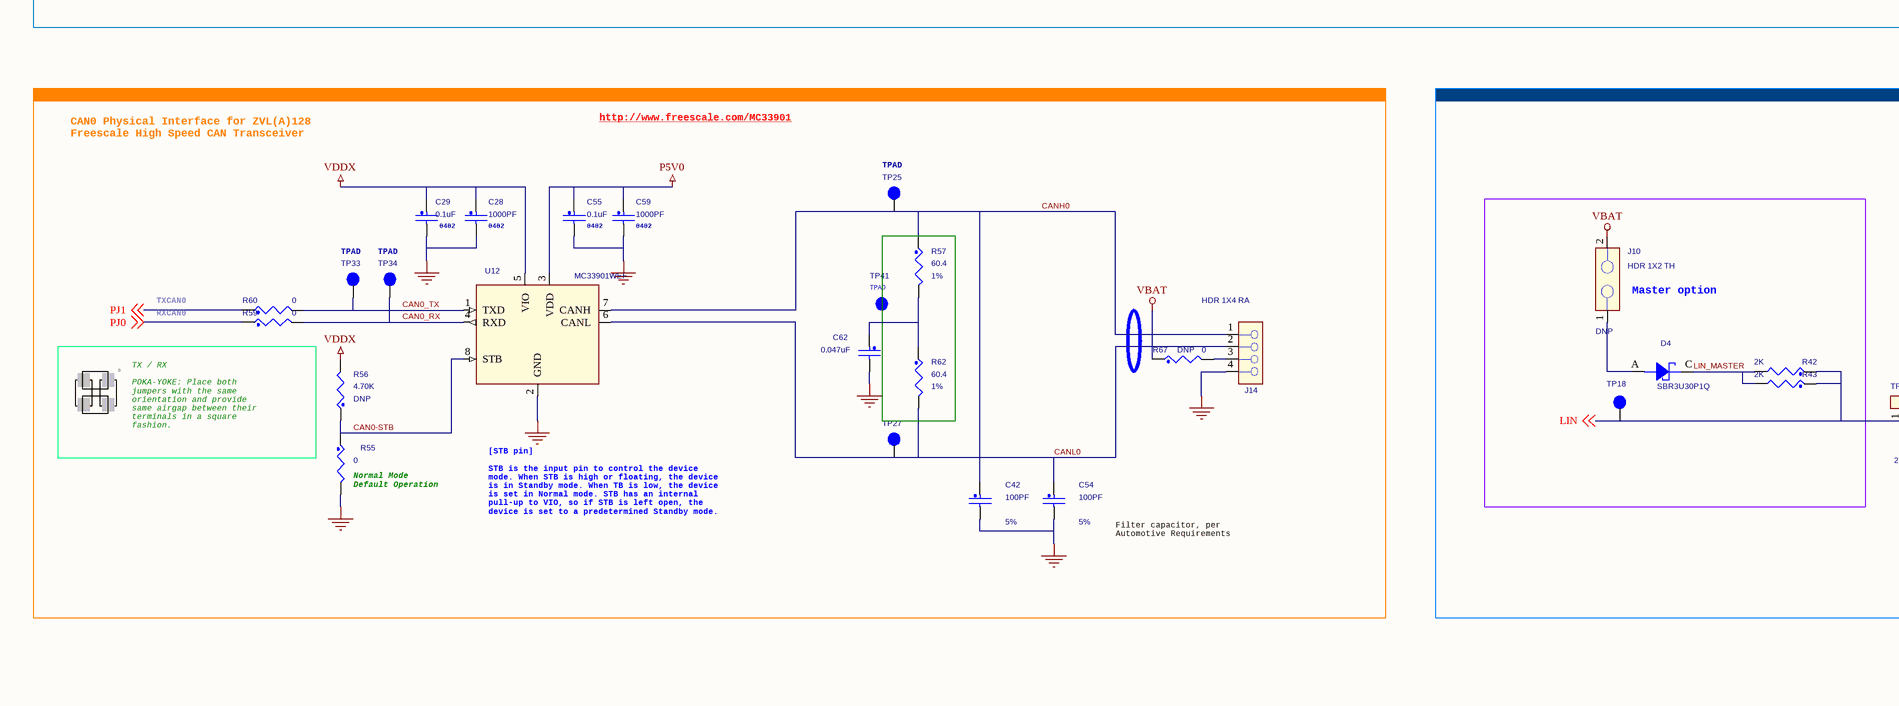
[diagram p5: 04.SchDoc, bottom left]
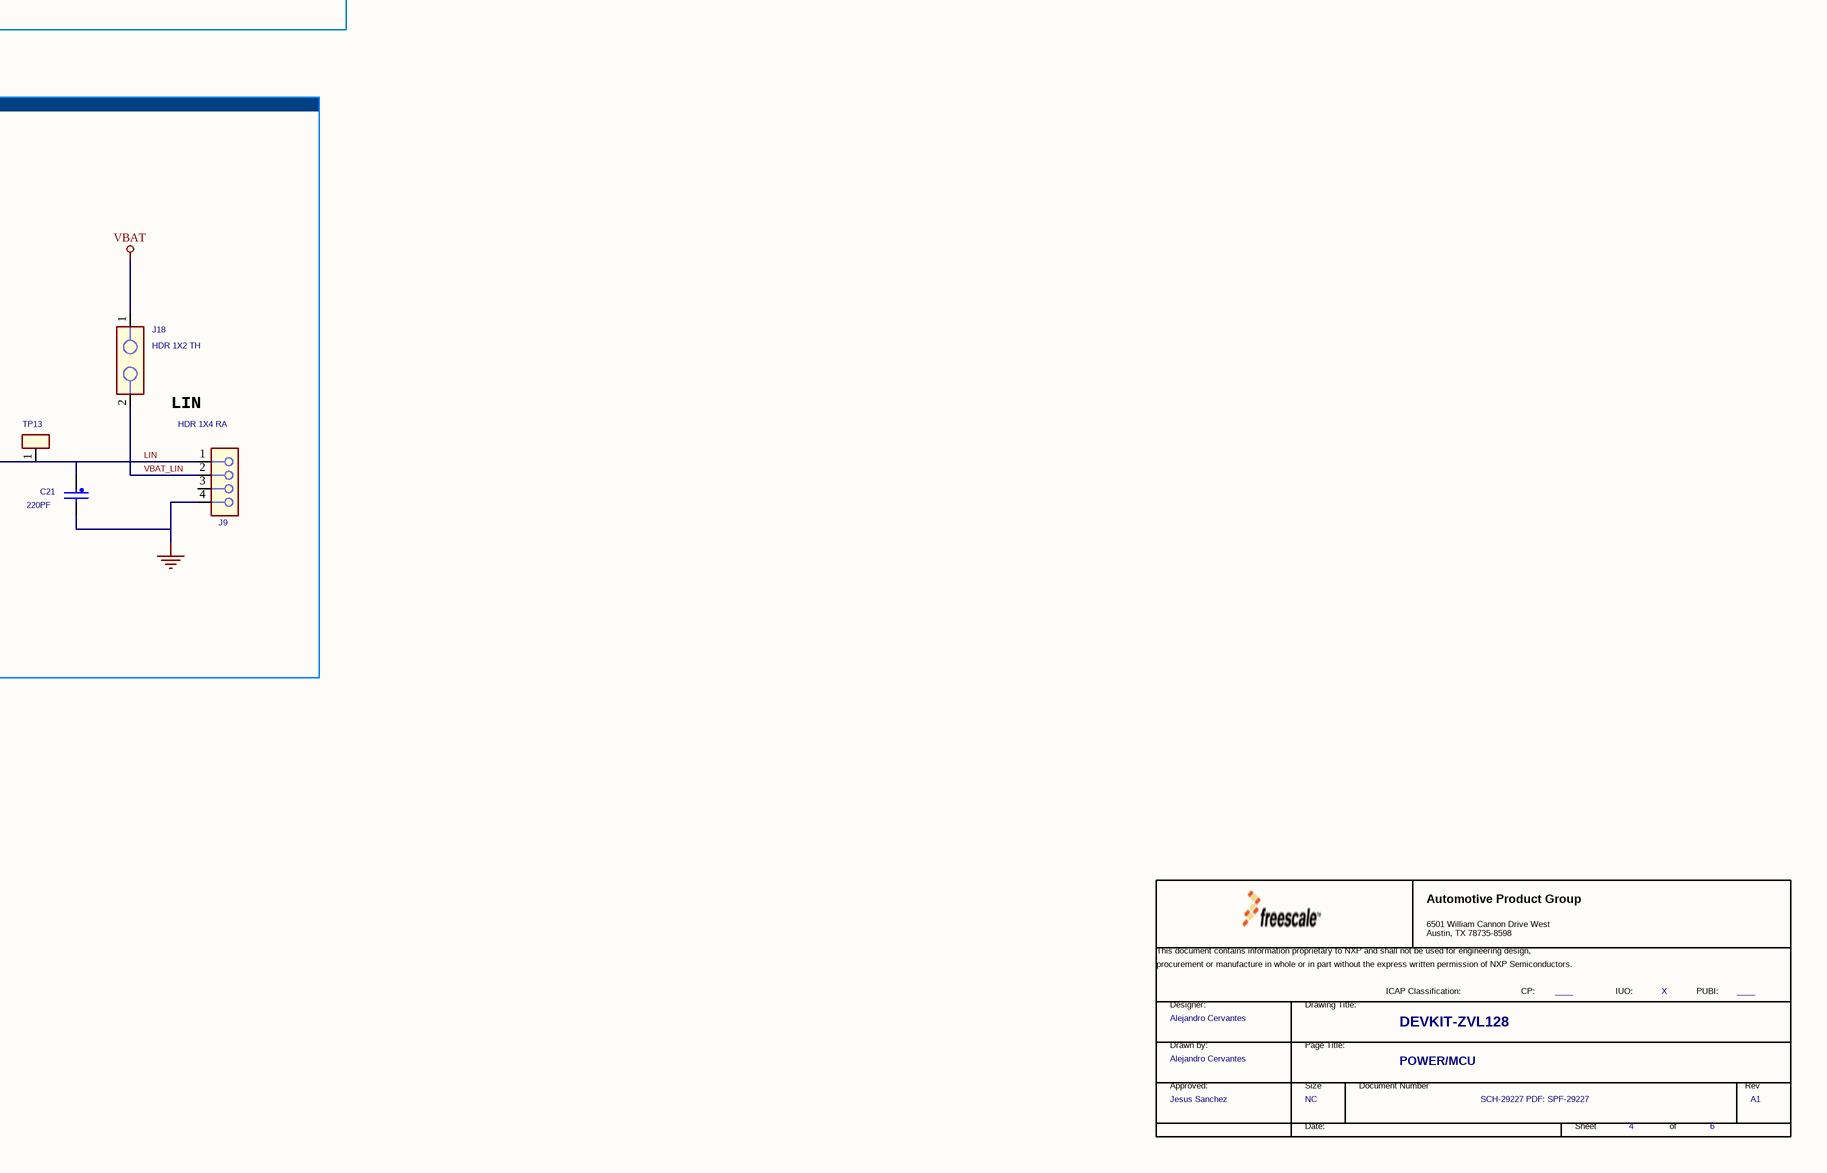
[diagram p6: 04.SchDoc, bottom right]

### Parts
(Parts that share a designator on the sheet are numbered #1, #2 ... from top to bottom, then left to right.)
*#3  FCP: ____  FIUO: X  DrawnBy: Alejandro Cervantes  Approver: Jesus Sanchez  PageTitle: POWER/MCU  Page Count: 6  Page Number: 4  Page Size: NC  Title: DEVKIT-ZVL128  RevCode: A1  Doc: SCH-29227 PDF: SPF-29227  (hidden comment: TitleBlock_AMPG)  (graphical)
C17  220PF  [CC0402_25]
C18  0.1uF  [CC0402_25]
C21  220PF  [CC0603_OV]
C27  0.1uF  [CC0402_25]
C28  1000PF  [CC0402_25]
C29  0.1uF  [CC0402_25]
C30  10UF  [CC0603_OV]
C31  0.22uF  [CC0402_25]
C32  1000PF  [CC0402_25]
C33  0.01UF  [CC0402_25]
C34  10UF  [CC0805_OV]
C36  0.01UF  [CC0402_25]
C37  0.01UF  [CC0402_25]
C39  0.1uF  [CC0402_25]
C40  0.1uF  [CC0402_25]
C42  100PF  TOL: 5%  [CC0402_25]
C43  0.1uF  [CC0402_25]
C44  10UF  [CC0603_OV]
C50  0.1uF  [CC0402_25]
C51  1uF  [CC0805_OV]
C54  100PF  TOL: 5%  [CC0402_25]
C55  0.1uF  [CC0402_25]
C57  0.1uF  [CC0402_25]
C58  0.22uF  [CC0402_25]
C59  1000PF  [CC0402_25]
C60  1000PF  [CC0402_25]
C61  47uF  [cce6p8x6p8]
C62  0.047uF  [CC0603_OV]
C63  0.1uF  [CC0402_25]
C64  0.1uF  [CC0402_25]
C65  470PF  [CC0603_OV]
C66  12PF  [CC0402_25]
C67  12PF  [CC0402_25]
C68  10UF  [CC0805_OV]
C69  1uF  [CC0805_OV]
C70  0.1uF  [CC0402_25]
C71  4.7uF  [CC0805_OV]
D1  ORANGE  [LED_0603]
D4  SBR3U30P1Q  [powerdi-123_3mmx2mm]
D5  SBR3U30P1Q  [powerdi-123_3mmx2mm]
D6  SBR3U30P1Q  [powerdi-123_3mmx2mm]
D7  SBR3U30P1Q  [powerdi-123_3mmx2mm]
D9  ORANGE  [LED_0603]
GND1  TESTLOOP  [testpoint_135_070mil]  (value not drawn)
GND2  TESTLOOP  [testpoint_135_070mil]  (value not drawn)
GND3  TESTLOOP  [testpoint_135_070mil]  (value not drawn)
GND4  TESTLOOP  [testpoint_135_070mil]  (value not drawn)
J8  HDR_2X3  [HDR203]
J9  HDR 1X4 RA  [con_hdr_4m_100_th_ra]
J10  HDR 1X2 TH  ASSY_OPT: DNP  [HDR102]
J11  HDR TH 1X3  [HDR103]
J12  HDR 1X2 TH  [HDR102]
J13  HDR TH 1X3  [HDR103]
J14  HDR 1X4 RA  [con_hdr_4m_100_th_ra]
J15  CON PWR 3  [con3_pwr_jack_th_pj051a]
J18  HDR 1X2 TH  [HDR102]
JP1  HDR_1X1  [HDR101]
L3  BLM31AJ601SN1L  [IND_1206]
Q1  BCP53-10  [sot223]
R38  330  [RC0402_25]
R42  2K  [RC0805_OV]
R43  2K  [RC0805_OV]
R51  1K  [RC0603_OV]
R52  0  [RC0402_25]
R53  0  ASSY_OPT: DNP  [RC0603_OV]
R54  0  ASSY_OPT: DNP  [RC0402_25]
R55  0  [RC0603_OV]
R56  4.70K  ASSY_OPT: DNP  [RC0603_OV]
R57  60.4  TOL: 1%  [RC1210]
R59  0  [RC0603_OV]
R60  0  [RC0603_OV]
R61  0  [RC0603_OV]
R62  60.4  TOL: 1%  [RC1210]
R63  0  ASSY_OPT: DNP  [RC0603_OV]
R66  330  [RC0402_25]
R67  0  ASSY_OPT: DNP  [RC0805_OV]
RST1  TESTLOOP  [testpoint_135_070mil]  (value not drawn)
SW1  EVQ-P2402W  [sw4_spst_4p8X3p6_2p5]
TP5  TPAD_028  [TPAD_028]  (value not drawn)
TP10  TESTLOOP  [testpoint_135_070mil]  (value not drawn)
TP13  TESTLOOP  [testpoint_135_070mil]  (value not drawn)
TP16  TPAD_028  [TPAD_028]  (value not drawn)
TP18  TPAD_028  [TPAD_028]  (value not drawn)
TP19  TPAD_030  [TPAD_030]  (value not drawn)
TP20  TPAD_028  [TPAD_028]  (value not drawn)
TP21  TPAD_030  [TPAD_030]  (value not drawn)
TP24  TPAD_030  [TPAD_030]  (value not drawn)
TP25  TPAD_028  [TPAD_028]  (value not drawn)
TP26  TPAD_028  [TPAD_028]  (value not drawn)
TP27  TPAD_028  [TPAD_028]  (value not drawn)
TP29  TESTLOOP  [testpoint_135_070mil]  (value not drawn)
TP30  TPAD_028  [TPAD_028]  (value not drawn)
TP31  TPAD_030  [TPAD_030]  (value not drawn)
TP32  TPAD_030  [TPAD_030]  (value not drawn)
TP33  TPAD_028  [TPAD_028]  (value not drawn)
TP34  TPAD_028  [TPAD_028]  (value not drawn)
TP35  TPAD_028  [TPAD_028]  (value not drawn)
TP36  TPAD_030  [TPAD_030]  (value not drawn)
TP38  TPAD_030  [TPAD_030]  (value not drawn)
TP41  TPAD_028  [TPAD_028]  (value not drawn)
TP42  TPAD_030  [TPAD_030]  (value not drawn)
TP44  TPAD_030  [TPAD_030]  (value not drawn)
TS1  TESTLOOP  [testpoint_135_070mil]  (value not drawn)
TS2  TESTLOOP  [testpoint_135_070mil]  (value not drawn)
U10  SPX3819M5-L-3-3  [SOT23_5S]
U11  PC9S12ZVL32  [LQFP48]
U12  MC33901WEF  [SO8_1P27_4X5]
U13  MIC5233-5.0YM5  [sot-23-5]
Y2  8MHZ  [xtal2_3p3x2p6]

### Blocks framed on the sheet
BDM Interface: C17 C18 D1 J8 R38 RST1 SW1 TP5 TP16
LDO Voltage Regulator 150mA / SOT23-5: C27 C30 C36 C43 C44 D5 R52 R54 TP20 TP26 TS1 U10
LDO Voltage Regulator 150mA / SOT23-5: C50 C51 C65 C70 C71 D7 R61 R63 TP31 TP42 TS2 U13
External PNP Ballast Transistor - VDDX/VDDA: C31-C34 C37 C57 C58 C60 C66-C69 D9 L3 Q1 R51 R66 TP10 TP19 TP21 TP32 TP36 TP44 U11 Y2
Power Supply Selection: J11 J13 JP1 R53 TP24 TP38
http://www.freescale.com/MC33901: C28 C29 C42 C54 C55 C59 C62 J14 R55-R57 R59 R60 R62 R67 TP25 TP27 TP33 TP34 TP41 U12
LIN: C21 J9 J18 TP13
Master option: D4 J10 R42 R43 TP18

### Nets
GND: C17.2 C18.2 C21.2 C27.2 C28.2 C29.2 C30.2 C31.2 C32.2 C33.2 C34.2 C36.2 C37.2 C39.2 C40.2 C42.2 C43.2 C44.2 C50.2 C51.2 C54.2 C55.2 C57.2 C58.2 C59.2 C60.2 C61.2 C62.2 C63.2 C65.2 C66.2 C67.2 C68.2 C69.2 C70.2 C71.2 D9.C(CATHODE) GND1.1 GND2.1 GND3.1 GND4.1 J8.2(B1) J9.4 J14.4 J15.2 J15.3 J15.SH1(SHIELD1) J15.SH2(SHIELD2) R54.1 R55.2 R63.1 SW1.1 SW1.3 U10.2(GND) U11.14(VSSA) U11.21(TEST) U11.25(LGND) U11.38(VSSX2) U11.46(VSSX1) U11.48(VSS) U12.2(GND) U13.2(GND)  [also labelled VSSA]
P3V3: J11.2 R53.2 TP24.1(Pin1)
P3V3_LR: C43.1 C44.1 J11.1 R53.1 TP26.1(Pin1) TS1.1 U10.5(VOUT)
P5V0: C55.1 C59.1 J13.2 TP38.1(Pin1) U12.3(VDD)
P5V0_LR: C70.1 C71.1 JP1.1 TP42.1(Pin1) TS2.1 U13.5(OUT)
P5V_SWUSB: J13.3
VBAT: C64.1 D7.A J10.2 J12.2 J15.1 J18.1 R67.1 TP29.1 TP35.1(Pin1)
VDDX: C18.1 C28.1 C29.1 C58.1 C60.1 C68.1 D5.A J8.6(B3) J11.3 J13.1 L3.2 Q1.2(COLLECTOR) Q1.4(COLLECTOR1) R38.1 R56.2 R66.1 TP10.1 TP32.1(Pin1) TP44.1(Pin1) U11.45(VDDX) U12.5(VIO)
VSUP: C32.1 C33.1 C37.1 C39.1 C40.1 C57.1 C61.1 C69.1 D6.C Q1.3(EMITTER) R51.1 TP21.1(Pin1) TP30.1(Pin1) TP36.1(Pin1) U11.1(VSUP)
AN0: U11.16(PAD0/KWAD0/AN0/VRH) ; off-sheet AN0
AN1: U11.13(PAD1/KWAD1/AN1/VRL) ; off-sheet AN1
AN2: U11.12(PAD2/KWAD2/AN2) ; off-sheet AN2
AN3: U11.11(PAD3/KWAD3/AN3) ; off-sheet AN3
AN4: U11.10(PAD4/KWAD4/AN4) ; off-sheet AN4
AN5: U11.9(PAD5/KWAD5/ETRIG0/AN5) ; off-sheet AN5
AN6: U11.8(PAD6/KWAD6/AN6) ; off-sheet AN6
AN7: U11.7(PAD7/KWAD7/AN7) ; off-sheet AN7
AN8: U11.6(PAD8/KWAD8/AN8) ; off-sheet AN8
AN9: U11.5(PAD9/KWAD9/AN9) ; off-sheet AN9
BCTL: Q1.1(BASE) R51.2 TP19.1(Pin1) U11.23(BCTL)
BKGD: J8.1(A1) TP5.1(Pin1) U11.26(BKGD/MODC) ; off-sheet BKGD
CAN0-STB: R55.1 R56.1 U12.8(STB)
CAN0_RX: R59.2 TP34.1(Pin1) U12.4(RXD)
CAN0_TX: R60.2 TP33.1(Pin1) U12.1(TXD)
CANH0: C42.1 J14.1 R57.1 TP25.1(Pin1) U12.7(CANH)
CANL0: C54.1 J14.2 R62.2 TP27.1(Pin1) U12.6(CANL)
EXTAL_ZVL32: C66.1 U11.3(PE0/ETRIG0/EXTAL) Y2.2
LIN: C21.1 J9.1 R42.1 R43.1 TP13.1 TP18.1(Pin1) U11.24(LIN) ; off-sheet LIN
LIN_MASTER: D4.C R42.2 R43.2
PJ0: R59.1 U11.41(PJ0/SDA0/PWM5) ; off-sheet PJ0
PJ1: R60.1 U11.42(PJ1/SCL0/PWM7) ; off-sheet PJ1
PL0: U11.2(PL0/HVI0/KWL0) ; off-sheet PL0
PP0: U11.30(PP0/KWP0/PWM0) ; off-sheet PP0
PP1: U11.47(PP1/KWP1/PWM1/IOC1_1) ; off-sheet PP1
PP2: U11.31(PP2/KWP2/PWM2) ; off-sheet PP2
PP3: U11.37(PP3/~{IRQ}/KWP3/PWM3) ; off-sheet PP3
PP4: U11.32(PP4/KWP4/PWM4) ; off-sheet PP4
PP5: U11.39(PP5/~{XIRQ}/KWP5/PWM5) ; off-sheet PP5
PP6: U11.18(PP6/KWP6/ETRIG0/PWM6) ; off-sheet PP6
PP7: U11.44(PP7/KWP7/PWM7/IOC1_0) ; off-sheet PP7
PS0: U11.28(PS0/KWS0/MISO0/PWM4/RXD0/IOC0_2) ; off-sheet PS0
PS1: U11.33(PS1/KWS1/MOSI0/PWM6/TXD0/LPDC0/IOC0_3) ; off-sheet PS1
PS2: U11.34(PS2/KWS2/SCK0/IOC0_4/DBGEEV) ; off-sheet PS2
PS3: U11.35(PS3/KWS3/~{SS0}/IOC0_5/ECLK) ; off-sheet PS3
PT0: U11.22(PT0/IOC0_0/SDA0/RXD1/PWM2/LPTXD0) ; off-sheet PT0
PT1: U11.27(PT1/IOC0_1/SCL0/TXD1/PWM0/LPRXD0) ; off-sheet PT1
PT2: U11.40(PT2/IOC0_2) ; off-sheet PT2
PT3: U11.43(PT3/IOC0_3) ; off-sheet PT3
PT4: U11.19(PT4/IOC0_4/RXD1) ; off-sheet PT4
PT5: U11.20(PT5/IOC0_5/TXD1) ; off-sheet PT5
PT6: U11.17(PT6/IOC1_0) ; off-sheet PT6
PT7: U11.29(PT7/IOC1_1) ; off-sheet PT7
RESET_B: C17.1 D1.C(CATHODE) J8.4(B2) RST1.1 SW1.2 SW1.4 TP16.1(Pin1) U11.36(~{RESET}) ; off-sheet RESET_B
RSTR: D1.A(ANODE) R38.2
VBAT_LIN: J9.2 J18.2
VDDA: C31.1 C34.1 L3.1 U11.15(VDDA)
XTAL_ZVL32: C67.1 U11.4(PE1/XTAL) Y2.1
NetC27_1: C27.1 C30.1 D5.C R52.1 TP20.1(Pin1) U10.1(VIN)
NetC36_1: C36.1 U10.4(BYP)
NetC50_1: C50.1 C51.1 D7.C R61.1 TP31.1(Pin1) U13.1(IN)
NetC62_1: C62.1 R57.2 R62.1 TP41.1(Pin1)
NetC63_1: C63.1 C64.2
NetC65_1: C65.1 U13.4(NC)
NetD4_A: D4.A J10.1
NetD6_A: D6.A J12.1
NetD9_A: D9.A(ANODE) R66.2
NetJ14_3: J14.3 R67.2
NetR52_2: R52.2 R54.2 U10.3(EN)
NetR61_2: R61.2 R63.2 U13.3(EN)

Not connected (* = marked no-connect by the designer): J8 3(A2) 5(A3); J9 3

### Notes on the sheet
- (near SW1) RESET
- (near C66) Place the components
  inside the header ring
- 0402
- MOSI0
- SCK0
- SS0_B
- MISO0
- I2C_SDA0
- I2C_SCL0
- PT1/TXD1
- PT4/RXD1
- PT5/TXD1
- PT0/RXD1
- CAN0 Physical Interface for ZVL(A)128
  Freescale High Speed CAN Transceiver
- (near TP25) TPAD
- TPAD
- (near C29) 0402
- (near C28) 0402
- (near C55) 0402
- (near C59) 0402
- TXCAN0
- RXCAN0
- (near TP41) TPAD
- TX / RX
  POKA-YOKE: Place both
  jumpers with the same
  orientation and provide
  same airgap between their
  terminals in a square
  fashion.
- (near R55) Normal Mode
  Default Operation
- [STB pin]
  STB is the input pin to control the device
  mode. When STB is high or floating, the device
  is in Standby mode. When TB is low, the device
  is set in Normal mode. STB has an internal
  pull-up to VIO, so if STB is left open, the
  device is set to a predetermined Standby mode.
- Filter capacitor, per
  Automotive Requirements
- (in symbol CAP_POL) +
- (in symbol TitleBlock_AMPG) Automotive Product Group; 6501 William Cannon Drive West / Austin, TX 78735-8598; This document contains information proprietary to NXP and shall not be used for engineering design,; procurement or manufacture in whole or in part without the express written permission of NXP Semiconductors.; ICAP Classification:; CP:; IUO:; PUBI:; Designer:; Drawing Title:; Drawn by:; Page Title:; Approved:; Size; Document Number; Rev; Date:; Sheet; of
- (in symbol TRAN_PNP_SOT223) E; B; C

### Library data of the parts
*#3 = TitleBlock_AMPG: as *#2 on sheet 05; PUBI: ____; Designer: Alejandro Cervantes; Page Create Date: March  8, 1995
C17 = CAP_NP: CAP CER 220PF 50V 5% C0G 0402; CLASS: DISCRETE; AGILE_PN: 150-30297; MFG_NAME01: KEMET; MFG_PN01: C0402C221J5GAC; CAD_APPROVED: Yes; FPLIST: CC0402_25,CC0402_HD,0402_CC; Tolerance: 5%; ROHS: Yes; HEIGHT: 0.55MM; VOLTAGE: 50V
C18 C27 C40 C43 C63 C64 C70 = CAP_NP: as C9 on sheet 06; Tolerance: 10%; ROHS: Yes; HEIGHT: 0.55MM; VOLTAGE: 50V
  C18: TOL: 10%
C21 = CAP_NP: CAP CER 220PF 50V 10% X7R 0603; CLASS: DISCRETE; AGILE_PN: 150-75200; MFG_NAME01: KEMET; MFG_PN01: C0603C221K5RAC; CAD_APPROVED: Yes; FPLIST: CC0603_OV,CC0603,0603_CC; Tolerance: 10%; ROHS: Yes; HEIGHT: 0.9652MM; VOLTAGE: 50V
C28 = CAP_NP: CAP CER 1000pF 50V 10% X7R AEC-Q200 0402; CLASS: DISCRETE; AGILE_PN: 150-79040; MFG_NAME01: MURATA; MFG_PN01: GCM155R71H102KA37D; CAD_APPROVED: Yes; FPLIST: CC0402_25,CC0402_HD,0402_CC; TOL: 10%; Tolerance: 10%; ROHS: Yes; HEIGHT: 0.55MM; VOLTAGE: 50V
C29 = CAP_NP: CAP CER 0.1uF 50V 10% X7R 0402; CLASS: DISCRETE; FPLIST: CC0402_25,CC0402_HD,0402_CC; CAD_APPROVED: Yes; MFG_PN01: GRM155R71H104KE14D; MFG_NAME01: MURATA; AGILE_PN: 150-79069; PRIORITY_PN: 021-00295; VOLTAGE: 50V; HEIGHT: 0.55MM; ROHS: Yes; Tolerance: 10%; TOL: 10%
C30 C44 = CAP_NP: CAP CER 10uF 25V 20% X5R 0603; CLASS: DISCRETE; AGILE_PN: 150-79272; MFG_NAME01: Murata; MFG_PN01: GRM188R61E106MA73D; CAD_APPROVED: Yes; FPLIST: CC0805_OV,CC0805,0805_CC; Tolerance: 20%; ROHS: Yes; HEIGHT: 1MM; VOLTAGE: 25V
C31 C58 = CAP_NP: CAP CER 0.22UF 16V 10% X7R 0402; CLASS: DISCRETE; AGILE_PN: 150-78886; MFG_NAME01: Murata; MFG_PN01: GRM155R71C224KA12D; CAD_APPROVED: Yes; FPLIST: CC0402_25,CC0402_HD,0402_CC; Tolerance: 10%; ROHS: Yes; HEIGHT: 0.55MM; VOLTAGE: 16V
C32 = CAP_NP: CAP CER 1000PF 50V 10% X7R 0402; CLASS: DISCRETE; AGILE_PN: 150-75271; Tolerance: +10%; MFG_NAME01: AVX; MFG_PN01: 04025C102KAT2A; CAD_APPROVED: Yes; FPLIST: CC0402_25,CC0402_HD,0402_CC; VOLTAGE: 50VDC; ROHS: Yes; HEIGHT: 0.635 MM
C33 C37 = CAP_NP: CAP CER 0.01uF 50V 5% X7R 0402; CLASS: DISCRETE; AGILE_PN: 150-30234; MFG_NAME01: VENKEL COMPANY; MFG_PN01: C0402X7R500-103JNE; CAD_APPROVED: Yes; FPLIST: CC0402_25,CC0402_HD,0402_CC; TOL: 5%; Tolerance: 5%; ROHS: Yes; HEIGHT: 0.55MM; VOLTAGE: 50V
C34 = CAP_NP: as C1 on sheet 06; VOLTAGE: 10V; HEIGHT: 1.4MM; ROHS: Yes; Tolerance: 10%
C36 = CAP_NP: as C3 on sheet 05; TOL: 20%; ROHS: Yes; HEIGHT: 0.56MM; Tolerance: 20%; VOLTAGE: 16V
C39 C50 = CAP_NP: as C2 on sheet 06; VOLTAGE: 50V; HEIGHT: 0.55MM; ROHS: Yes; Tolerance: 10%
C42 C54 = CAP_NP: CAP CER 100pF 50V 5% C0G AEC-Q200 0402; CLASS: DISCRETE; AGILE_PN: 150-79021; MFG_NAME01: MURATA; MFG_PN01: GCM1555C1H101JA16B; CAD_APPROVED: Yes; FPLIST: CC0402_25,CC0402_HD,0402_CC; ROHS: Yes; HEIGHT: 0.55MM; VOLTAGE: 50V; Tolerance: 5%
C51 = CAP_NP: CAP CER 1uF 50V 10% X7R AEC-Q200 0805; CLASS: DISCRETE; FPLIST: CC0805_OV,CC0805,0805_CC; CAD_APPROVED: Yes; MFG_PN01: GCM21BR71H105KA03; MFG_NAME01: Murata; AGILE_PN: 150-79208; VOLTAGE: 50V; HEIGHT: 1.4MM; ROHS: Yes; Tolerance: 10%
C55 = CAP_NP: CAP CER 0.1uF 50V 10% X7R 0402; CLASS: DISCRETE; PRIORITY_PN: 021-00295; AGILE_PN: 150-79069; MFG_NAME01: MURATA; MFG_PN01: GRM155R71H104KE14D; CAD_APPROVED: Yes; FPLIST: CC0402_25,CC0402_HD,0402_CC; TOL: 10%; Tolerance: 10%; ROHS: Yes; HEIGHT: 0.55MM; VOLTAGE: 50V
C57 = CAP_NP: CAP CER 0.1uF 50V 10% X7R 0402; CLASS: DISCRETE; FPLIST: CC0603_OV,CC0603,0603_CC; CAD_APPROVED: Yes; MFG_PN01: GRM155R71H104KE14D; MFG_NAME01: MURATA; AGILE_PN: 150-79069; VOLTAGE: 50V; HEIGHT: 0.55MM; ROHS: Yes; Tolerance: 10%
C59 = CAP_NP: CAP CER 1000pF 50V 10% X7R AEC-Q200 0402; CLASS: DISCRETE; FPLIST: CC0402_25,CC0402_HD,0402_CC; CAD_APPROVED: Yes; MFG_PN01: GCM155R71H102KA37D; MFG_NAME01: MURATA; AGILE_PN: 150-79040; VOLTAGE: 50V; HEIGHT: 0.55MM; ROHS: Yes; Tolerance: 10%; TOL: 10%
C60 = CAP_NP: CAP CER 1000pF 50V 10% X5R 0402; CLASS: DISCRETE; AGILE_PN: 150-78971; MFG_NAME01: TDK; MFG_PN01: C1005X5R1H102K; CAD_APPROVED: Yes; FPLIST: CC0402_25,CC0402_HD,0402_CC; VOLTAGE: 50%; Tolerance: 10%; ROHS: Yes; HEIGHT: 0.55 MM
C61 = CAP_POL: CAP ALEL 47uF 25V 20% -- SMT; CLASS: DISCRETE; AGILE_PN: 150-79138; MFG_NAME01: NICHICON; MFG_PN01: UUD1E470MCL1GS; CAD_APPROVED: Yes; Tolerance: 20%; ROHS: Yes; HEIGHT: 6.1MM; VOLTAGE: 25V
C62 = CAP_NP: CAP CER 0.047uF 100V 10% X7R 0603; CLASS: DISCRETE; FPLIST: CC0603_OV,CC0603,0603_CC; CAD_APPROVED: Yes; MFG_PN01: C0603C473K1RACTU; MFG_NAME01: Kemet; AGILE_PN: 150-79125; VOLTAGE: 100V; HEIGHT: 0.87MM; ROHS: Yes; Tolerance: 10%
C65 = CAP_NP: CAP CER 470PF 50V 10% X7R 0603; CLASS: DISCRETE; AGILE_PN: 150-75277; MFG_NAME01: AVX; MFG_PN01: 06035C471KAT2A; CAD_APPROVED: YES; FPLIST: CC0603_OV,CC0603,0603_CC; Tolerance: 10%; ROHS: Yes; HEIGHT: 0.9652MM; VOLTAGE: 50V
C66 C67 = CAP_NP: CAP CER 12PF 50V 5% C0G 0402; CLASS: DISCRETE; AGILE_PN: 150-75680; MFG_NAME01: MURATA; MFG_PN01: GRM1555C1H120JZ01D; CAD_APPROVED: Yes; FPLIST: CC0402_25,CC0402_HD,0402_CC; Tolerance: 5%; ROHS: Yes; HEIGHT: 0.55MM; VOLTAGE: 50V
C68 = CAP_NP: as C5 on sheet 06; Tolerance: 10%; ROHS: Yes; HEIGHT: 1.4MM; VOLTAGE: 10V
C69 = CAP_NP: CAP CER 1uF 50V 10% X7R AEC-Q200 0805; CLASS: DISCRETE; AGILE_PN: 150-79208; MFG_NAME01: Murata; MFG_PN01: GCM21BR71H105KA03; CAD_APPROVED: Yes; FPLIST: CC0805_OV,CC0805,0805_CC; Tolerance: 10%; ROHS: Yes; HEIGHT: 1.4MM; VOLTAGE: 50V
C71 = CAP_NP: CAP CER 4.7UF 16V 10% X7R 0805; CLASS: DISCRETE; FPLIST: CC0805_OV,CC0805,0805_CC; CAD_APPROVED: Yes; MFG_PN01: C0805C475K4RACTU; MFG_NAME01: Kemet; AGILE_PN: 150-79241; VOLTAGE: 16V; HEIGHT: 1.4MM; ROHS: Yes; Tolerance: 10%
D1 D9 = LED: LED ULTRA BRIGHT ORANGE 20MA 2V SMT 0603; CLASS: IC; CAD_APPROVED: Yes; MFG_PN01: LTST-C190KFKT; MFG_NAME01: LITE ON; AGILE_PN: 370-75080; HEIGHT: 0.8MM; ROHS: Yes
D4 D5 D7 = DIODE_SCHTKY: DIODE SCH RECT 3A 30V AEC-Q101 POWERDI-123; CLASS: IC; CAD_APPROVED: Yes; MFG_PN01: SBR3U30P1Q-7; MFG_NAME01: DIODES INC; AGILE_PN: 480-78627; HEIGHT: 1MM; ROHS: Yes
D6 = DIODE_SCHTKY: DIODE SCH RECT 3A 30V AEC-Q101 POWERDI-123; CLASS: IC; AGILE_PN: 480-78627; MFG_NAME01: DIODES INC; MFG_PN01: SBR3U30P1Q-7; CAD_APPROVED: Yes; ROHS: Yes; HEIGHT: 1MM
GND1 GND3 GND4 RST1 TP13 TS1 = TEST_POINT: TEST POINT PAD SIZE 3.4MM X 1.8MM SMT; CLASS: IC; PRIORITY_PN: 922-00014; CAD_APPROVED: Yes; MFG_PN01: 5015; MFG_NAME01: KEYSTONE ELECTRONICS; AGILE_PN: 211-75906; HEIGHT: 1.53 MM; ROHS: Yes
GND2 TP10 TP29 TS2 = TEST_POINT: TEST POINT PAD SIZE 3.4MM X 1.8MM SMT; CLASS: IC; AGILE_PN: 211-75906; MFG_NAME01: KEYSTONE ELECTRONICS; MFG_PN01: 5015; CAD_APPROVED: Yes; PRIORITY_PN: 922-00014; ROHS: Yes; HEIGHT: 1.53 MM
J8 = CONN_HDR_3X2: HDR 2X3 TH 100MIL CTR 330H SN 115L; CLASS: IO; CAD_APPROVED: Yes; MFG_PN01: TSW-103-23-T-D; MFG_NAME01: Samtec; AGILE_PN: 210-79360; HEIGHT: 8.58MM; ROHS: Yes
J9 = CONN_HDR_4X1: HDR 1X4 TH RA 100MIL SP 268H AU 124L; CLASS: IO; CAD_APPROVED: Yes; MFG_PN01: 0022122041; MFG_NAME01: MOLEX; AGILE_PN: 210-79929; HEIGHT: 6.81MM; ROHS: Yes
J10 J18 = JUMPER_2_2mm: HDR 1X2 TH 100MIL SP 339H AU 98L; CLASS: IO; FPLIST: HDR102,SH_HDR102_BOTTOM; CAD_APPROVED: YES; MFG_PN01: TSW-102-07-G-S; MFG_NAME01: SAMTEC; AGILE_PN: 210-80468; HEIGHT: 8.71 MM; ROHS: Yes
J11 J13 = CONN_HDR_3X1: HDR 1X3 TH 100MIL SP 339H AU 100L; CLASS: IO; AGILE_PN: 210-80732; MFG_NAME01: SAMTEC; MFG_PN01: TSW-103-07-G-S; CAD_APPROVED: Yes; ROHS: Yes; HEIGHT: 8.65MM
J12 = JUMPER_2_2mm: as J16 on sheet 05; ROHS: Yes; HEIGHT: 8.71 MM
J14 = CONN_HDR_4X1: HDR 1X4 TH RA 100MIL SP 268H AU 124L; CLASS: IO; AGILE_PN: 210-79929; MFG_NAME01: MOLEX; MFG_PN01: 0022122041; CAD_APPROVED: Yes; ROHS: Yes; HEIGHT: 6.81MM
J15 = DC_POWER_JACK_SHD: CON 3 PWR JACK RA TH 295H -- NI 98L; CLASS: IO; AGILE_PN: 210-79945; MFG_NAME01: CUI INC; MFG_PN01: PJ-051A; CAD_APPROVED: Yes; ROHS: Yes; HEIGHT: 7.5MM
JP1 = CONN_HDR_1X1: HDR 1X1 TH 100MIL SP 338H AU 150L; CLASS: IO; AGILE_PN: 210-80028; MFG_NAME01: SAMTEC; MFG_PN01: HMTSW-101-24-SM-S-230; CAD_APPROVED: Yes; ROHS: Yes; HEIGHT: 8.59MM
L3 = BEAD: IND FER BEAD 600OHM@100MHZ 200MA 25% 1206; PART_TYPE: FERRITE; CLASS: DISCRETE; AGILE_PN: 180-75935; MFG_NAME01: MURATA; CAD_APPROVED: Yes; FPLIST: IND_1206,1206_CC; Tolerance: 25%; MFG_PN01: BLM31AJ601SN1L; ROHS: Yes; HEIGHT: 1.3MM
Q1 = TRAN_PNP_SOT223: TRAN PNP GEN 1.5A 80V SOT-223; CLASS: IC; AGILE_PN: 480-78401; MFG_NAME01: On Semiconductor; MFG_PN01: BCP53-10T1G; CAD_APPROVED: Yes; ROHS: Yes; HEIGHT: 1.75 MM
R38 = RES: RES MF 330 OHM 1/16W 1% AEC-Q200 0402; CLASS: DISCRETE; FPLIST: RC0402_25,RC0402_HD,0402_CC; CAD_APPROVED: Yes; MFG_PN01: RK73H1ETTP3300F; MFG_NAME01: KOA SPEER; AGILE_PN: 470-76465; ROHS: Yes; Tolerance: 1%; HEIGHT: 0.4MM
R42 R43 = RES: RES MF 2K 1/8W 1% 0805; CLASS: DISCRETE; FPLIST: RC0805_OV,RC0805,0805_CC; CAD_APPROVED: Yes; MFG_PN01: CR0805-FX-2001ELF; MFG_NAME01: BOURNS; AGILE_PN: 470-76341; HEIGHT: 0.65MM; ROHS: Yes; Tolerance: 1%
R51 = RES: as R40 on sheet 06; HEIGHT: 0.6MM; TOL: 5%; ROHS: Yes; Tolerance: 5%
R52 = RES: RES MF ZERO OHM 1/16W -- AEC-Q200 0402; CLASS: DISCRETE; AGILE_PN: 470-80742; MFG_NAME01: VISHAY INTERTECHNOLOGY; MFG_PN01: CRCW04020000Z0ED; CAD_APPROVED: Yes; FPLIST: RC0402_25,RC0402_HD,0402_CC; ROHS: Yes; HEIGHT: 0.45 MM
R53 R63 = RES: RES MF ZERO OHM 1/10W -- AEC-Q200 0603; CLASS: DISCRETE; FPLIST: RC0603_OV,RC0603,R603-X2,0603_CC; CAD_APPROVED: Yes; MFG_PN01: RK73Z1JTTD; MFG_NAME01: KOA SPEER; Tolerance: 1%; AGILE_PN: 470-75407; HEIGHT: 0.6MM; ROHS: Yes
R54 = RES: RES MF ZERO OHM 1/16W -- AEC-Q200 0402; CLASS: DISCRETE; FPLIST: RC0402_25,RC0402_HD,0402_CC; CAD_APPROVED: Yes; MFG_PN01: CRCW04020000Z0ED; MFG_NAME01: VISHAY INTERTECHNOLOGY; AGILE_PN: 470-80742; HEIGHT: 0.45 MM; ROHS: Yes
R55 = RES: RES MF ZERO OHM 1/10W -- AEC-Q200 0603; CLASS: DISCRETE; FPLIST: RC0603_OV,RC0603,R603-X2,0603_CC; CAD_APPROVED: Yes; MFG_PN01: RK73Z1JTTD; MFG_NAME01: KOA SPEER; Tolerance: 1%; AGILE_PN: 470-75407; PRIORITY_PN: 006-00371; ROHS: Yes; TOL: 1%; HEIGHT: 0.6MM
R56 = RES: RES MF 4.70K 1/10W 1% 0603; CLASS: DISCRETE; FPLIST: RC0603_OV,RC0603,0603_CC; CAD_APPROVED: Yes; MFG_PN01: RK73H1JTTD4701F; MFG_NAME01: KOA SPEER; AGILE_PN: 470-75430; PRIORITY_PN: 006-00377; ROHS: Yes; Tolerance: 1%; TOL: 1%; HEIGHT: 0.55 MM
R57 = RES: RES MF 60.4 OHM 1/2W 1% 1210; CLASS: DISCRETE; FPLIST: RC1210,1210_CC; CAD_APPROVED: Yes; MFG_PN01: ERJ14NF60R4U; MFG_NAME01: Panasonic; AGILE_PN: 470-80276; HEIGHT: 0.7MM; ROHS: Yes; Tolerance: 1%
R59-R61 = RES: RES MF ZERO OHM 1/10W -- AEC-Q200 0603; CLASS: DISCRETE; AGILE_PN: 470-75407; Tolerance: 1%; MFG_NAME01: KOA SPEER; MFG_PN01: RK73Z1JTTD; CAD_APPROVED: Yes; FPLIST: RC0603_OV,RC0603,R603-X2,0603_CC; HEIGHT: 0.6MM; ROHS: Yes
R62 = RES: RES MF 60.4 OHM 1/2W 1% 1210; CLASS: DISCRETE; AGILE_PN: 470-80276; MFG_NAME01: Panasonic; MFG_PN01: ERJ14NF60R4U; CAD_APPROVED: Yes; FPLIST: RC1210,1210_CC; ROHS: Yes; HEIGHT: 0.7MM; Tolerance: 1%
R66 = RES: RES MF 330 OHM 1/16W 1% AEC-Q200 0402; CLASS: DISCRETE; AGILE_PN: 470-76465; MFG_NAME01: KOA SPEER; MFG_PN01: RK73H1ETTP3300F; CAD_APPROVED: Yes; FPLIST: RC0402_25,RC0402_HD,0402_CC; HEIGHT: 0.4MM; Tolerance: 1%; ROHS: Yes
R67 = RES: RES MF ZERO 1/8W AEC-Q200 0805; CLASS: DISCRETE; FPLIST: RC0805_OV,RC0805,RC0805_OV_3P,0805_CC; CAD_APPROVED: Yes; MFG_PN01: RK73Z2ATTD; MFG_NAME01: KOA SPEER; AGILE_PN: 470-80547; HEIGHT: 0.65 MM; ROHS: Yes
SW1 = EDGE_MOUNT_PB_SW_2: as SW3 on sheet 05; MFG_PN01: EVQ-P2402W; ROHS: Yes; HEIGHT: 2.7 MM
TP5 TP18 TP26 TP33 TP34 TP41 = TestLoop: as TP2 on sheet 06; HEIGHT: 0.1 MM; ROHS: Yes; MFG_PN01: N/A; MFG_NAME01: N/A
TP16 TP20 TP25 TP27 TP30 TP35 = TestLoop: as TP6 on sheet 06; MFG_NAME01: N/A; MFG_PN01: N/A; ROHS: Yes; HEIGHT: 0.1 MM
TP19 TP21 TP31 TP32 TP44 = TestLoop: TEST POINT PAD 30MIL DIA SMT, NO PART TO ORDER; CLASS: IO; CAD_APPROVED: Yes; MFG_PN01: NOTACOMPONENT; AGILE_PN: 211-76642; HEIGHT: 0.1MM; ROHS: Yes; MFG_NAME01: NOTACOMPONENT
TP24 TP36 TP38 TP42 = TestLoop: TEST POINT PAD 30MIL DIA SMT, NO PART TO ORDER; CLASS: IO; AGILE_PN: 211-76642; MFG_NAME01: NOTACOMPONENT; CAD_APPROVED: Yes; MFG_PN01: NOTACOMPONENT; ROHS: Yes; HEIGHT: 0.1MM
U10 = SPX3819M5_FIX_5P: IC VREG LDO 3.3V 500MA 2.5-16V SOT-23-5; CAD_APPROVED: Yes; MFG_NAME01: EXAR; AGILE_PN: 315-79574; CLASS: IC; HEIGHT: 1.45 MM; ROHS: Yes; MFG_PN01: SPX3819M5-L-3-3
U11 = PC9S12ZVL32: IC MCU 32K FLASH 1K RAM 5.5-18V LQFP48; AGILE_PN: TMP-WF-17785; MFG_NAME01: FREESCALE SEMICONDUCTOR; MFG_PN01: PC912ZVL32F0VLF; PRE_APN: 344-01476; CAD_APPROVED: Yes; VOLTAGE: 6-18V; CLASS: IC; ROHS: Yes; HEIGHT: 1.6 MM
U12 = MC33901WEF-8P_4: IC INTERFACE CAN HS 60KB/S-1MB/S 4.5-5.5V SOIC8; CAD_APPROVED: Yes; MFG_NAME01: FREESCALE SEMICONDUCTOR; AGILE_PN: 312-80788; CLASS: IC; HEIGHT: 1.75MM; ROHS: Yes; MFG_PN01: MC33901WEF
U13 = MIC5233_SOT23_5P: IC VREG LDO 5V 2.3-36V SOT23-5; CAD_APPROVED: Yes; MFG_NAME01: MICREL; AGILE_PN: 315-79687; CLASS: IC; HEIGHT: 1.45 MM; ROHS: Yes; MFG_PN01: MIC5233-5.0YM5
Y2 = XTAL_CS10: XTAL 8MHZ 8pF AEC-Q200 SMD; CLASS: IC; AGILE_PN: 230-77981; MFG_NAME01: NDK; MFG_PN01: NX3225GD-8MHZ-STD-CRA-3; CAD_APPROVED: Yes; ROHS: Yes; HEIGHT: 1MM

## Sheet 03.SchDoc
size 386 x 246 mm
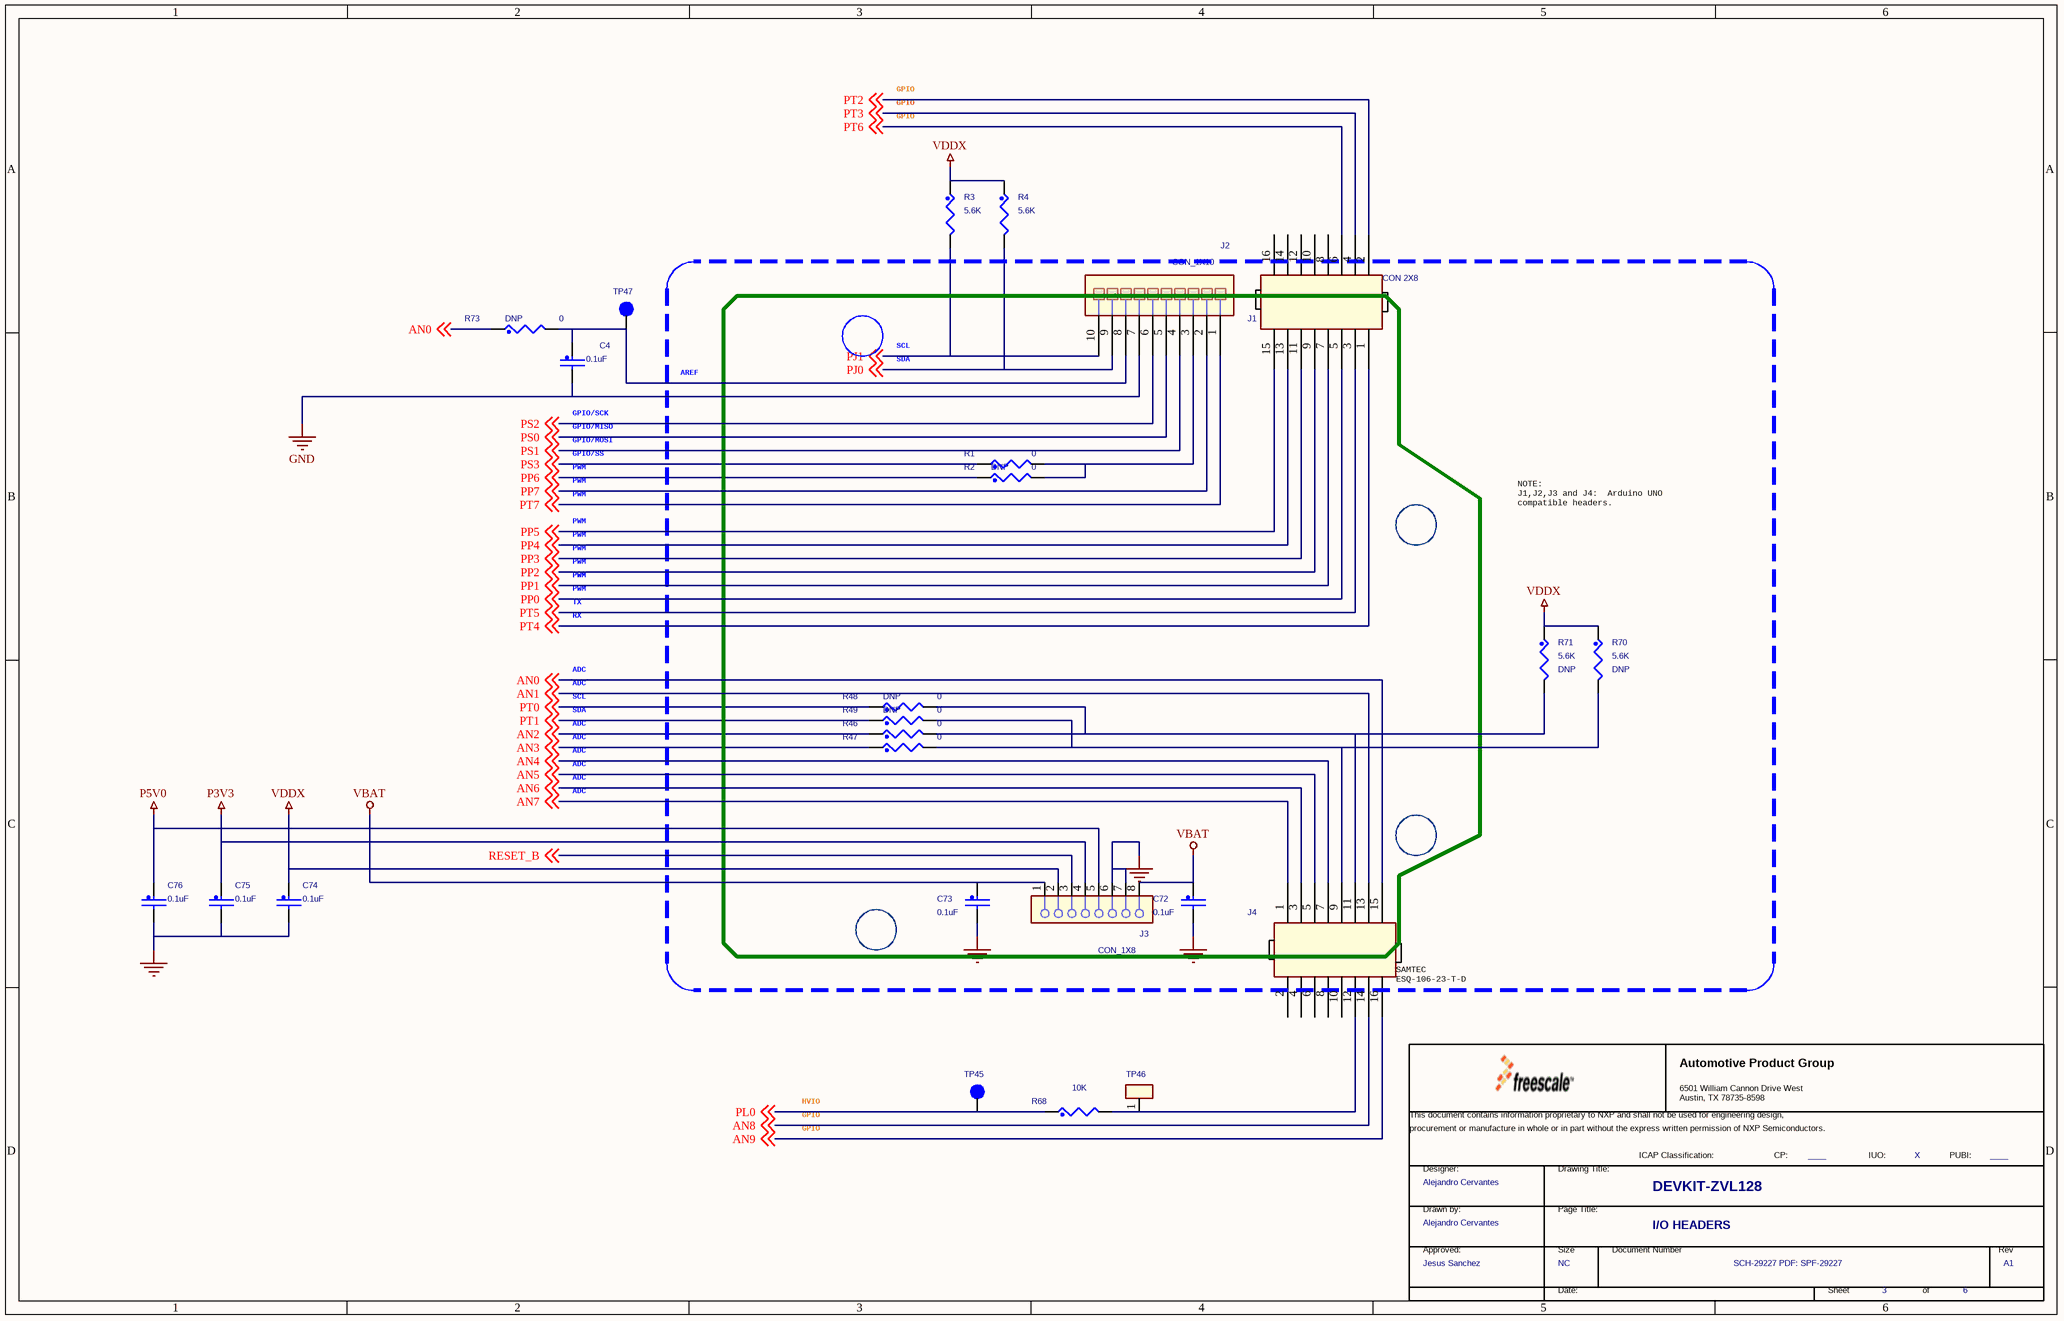
[diagram p7: 03.SchDoc]

### Parts
(Parts that share a designator on the sheet are numbered #1, #2 ... from top to bottom, then left to right.)
*#4  FCP: ____  FIUO: X  DrawnBy: Alejandro Cervantes  Approver: Jesus Sanchez  PageTitle: I/O HEADERS  Page Count: 6  Page Number: 3  Page Size: NC  Title: DEVKIT-ZVL128  RevCode: A1  Doc: SCH-29227 PDF: SPF-29227  (hidden comment: TitleBlock_AMPG)  (graphical)
C4  0.1uF  [CC0402_25]
C72  0.1uF  [CC0402_25]
C73  0.1uF  [CC0402_25]
C74  0.1uF  [CC0402_25]
C75  0.1uF  [CC0402_25]
C76  0.1uF  [CC0402_25]
J1  CON 2X8  [con_skt2x8_th]
J2  CON_1X10  [HDR110]
J3  CON_1X8  [con_1x8_skt_2p54_th]
J4  CON 2X8  [con_skt2x8_th]  (value not drawn)
R1  0  [RC0402_25]
R2  0  ASSY_OPT: DNP  [RC0402_25]
R3  5.6K  [RC0603_OV]
R4  5.6K  [RC0603_OV]
R46  0  [RC0402_25]
R47  0  [RC0402_25]
R48  0  ASSY_OPT: DNP  [RC0402_25]
R49  0  ASSY_OPT: DNP  [RC0402_25]
R68  10K  [RC0603_OV]
R70  5.6K  ASSY_OPT: DNP  [RC0603_OV]
R71  5.6K  ASSY_OPT: DNP  [RC0603_OV]
R73  0  ASSY_OPT: DNP  [RC0402_25]
TP45  TPAD_030  [TPAD_030]  (value not drawn)
TP46  TESTLOOP  [testpoint_135_070mil]  (value not drawn)
TP47  TPAD_030  [TPAD_030]  (value not drawn)

### Nets
GND: C4.2 C72.2 C73.2 C74.2 C75.2 C76.2 J2.7 J3.6 J3.7
P3V3: C75.1 J3.4
P5V0: C76.1 J3.5
VBAT: C72.1 C73.1 J3.1 J3.8
VDDX: C74.1 J3.2 R3.1 R4.1 R70.1 R71.1
AN0: J4.15 R73.1 ; off-sheet AN0
AN1: J4.13 ; off-sheet AN1
AN2: R46.1 ; off-sheet AN2
AN3: R47.1 ; off-sheet AN3
AN4: J4.7 ; off-sheet AN4
AN5: J4.5 ; off-sheet AN5
AN6: J4.3 ; off-sheet AN6
AN7: J4.1 ; off-sheet AN7
AN8: J4.14 ; off-sheet AN8
AN9: J4.16 ; off-sheet AN9
PJ0: J2.9 R4.2 ; off-sheet PJ0
PJ1: J2.10 R3.2 ; off-sheet PJ1
PL0: R68.1 TP45.1(Pin1) ; off-sheet PL0
PP0: J1.5 ; off-sheet PP0
PP1: J1.7 ; off-sheet PP1
PP2: J1.9 ; off-sheet PP2
PP3: J1.11 ; off-sheet PP3
PP4: J1.13 ; off-sheet PP4
PP5: J1.15 ; off-sheet PP5
PP6: R2.1 ; off-sheet PP6
PP7: J2.2 ; off-sheet PP7
PS0: J2.5 ; off-sheet PS0
PS1: J2.4 ; off-sheet PS1
PS2: J2.6 ; off-sheet PS2
PS3: R1.1 ; off-sheet PS3
PT0: R48.1 ; off-sheet PT0
PT1: R49.1 ; off-sheet PT1
PT2: J1.2 ; off-sheet PT2
PT3: J1.4 ; off-sheet PT3
PT4: J1.1 ; off-sheet PT4
PT5: J1.3 ; off-sheet PT5
PT6: J1.6 ; off-sheet PT6
PT7: J2.1 ; off-sheet PT7
RESET_B: J3.3 ; off-sheet RESET_B
NetC4_1: C4.1 J2.8 R73.2 TP47.1(Pin1)
NetJ2_3: J2.3 R1.2 R2.2
NetJ4_9: J4.9 R47.2 R49.2 R70.2
NetJ4_11: J4.11 R46.2 R48.2 R71.2
NetJ4_12: J4.12 R68.2 TP46.1

Not connected (* = marked no-connect by the designer): J1 8 10 12 14 16; J4 2 4 6 8 10

### Notes on the sheet
- GPIO
- AREF
- SCL
- SDA
- GPIO/SS
- GPIO/MOSI
- GPIO/MISO
- (near C4) GPIO/SCK
- PWM
- NOTE:
  J1,J2,J3 and J4:  Arduino UNO
  compatible headers.
- RX
- TX
- ADC
- (near J4) SAMTEC
  ESQ-106-23-T-D
- HVIO
- (in symbol TitleBlock_AMPG) Automotive Product Group; 6501 William Cannon Drive West / Austin, TX 78735-8598; This document contains information proprietary to NXP and shall not be used for engineering design,; procurement or manufacture in whole or in part without the express written permission of NXP Semiconductors.; ICAP Classification:; CP:; IUO:; PUBI:; Designer:; Drawing Title:; Drawn by:; Page Title:; Approved:; Size; Document Number; Rev; Date:; Sheet; of

### Library data of the parts
*#4 = TitleBlock_AMPG: as *#1 on sheet 06; PUBI: ____; Designer: Alejandro Cervantes; Page Create Date: March  8, 1995
C4 C72 C73 = CAP_NP: as C2 on sheet 06; HEIGHT: 0.55MM; ROHS: Yes; Tolerance: 10%; VOLTAGE: 50V
C74-C76 = CAP_NP: as C9 on sheet 06; Tolerance: 10%; ROHS: Yes; HEIGHT: 0.55MM; VOLTAGE: 50V
J1 J4 = HDR_2X8_M: CON 2X8 SKT TH 100MIL SP 335H AU 104L; CLASS: IO; CAD_APPROVED: Yes; MFG_PN01: SSW-108-01-S-D; MFG_NAME01: SAMTEC; AGILE_PN: 210-80983; HEIGHT: 8.76MM; ROHS: Yes
J2 = RCPT 1X10: CON 1X10 SKT TH 100MIL SP 335H AU; AGILE_PN: 210-75438; MFG_NAME01: SAMTEC; MFG_PN01: SSW-110-01-G-S; CAD_APPROVED: Yes; ROHS: Yes; HEIGHT: 8.51 MM
J3 = CONN_HDR_8X1: CON 1X8 SKT TH 100MIL SP 335H AU 104L; CLASS: IO; CAD_APPROVED: Yes; MFG_PN01: SSW-108-01-G-S; MFG_NAME01: SAMTEC; AGILE_PN: 210-79539; HEIGHT: 8.51MM; ROHS: Yes
R1 R2 R46 R47 R49 R73 = RES: as R52 on sheet 04; ROHS: Yes; HEIGHT: 0.45 MM
R3 R4 R70 R71 = RES: RES MF 5.6K 1/10W 1% 0603; CLASS: DISCRETE; FPLIST: RC0603_OV,RC0603,0603_CC; CAD_APPROVED: Yes; MFG_PN01: RK73H1JTTD5601F; MFG_NAME01: KOA SPEER; AGILE_PN: 470-78026; HEIGHT: 0.55MM; ROHS: Yes; Tolerance: 1%
R48 = RES: as R54 on sheet 04; HEIGHT: 0.45 MM; ROHS: Yes
R68 = RES: RES MF 10K 1/10W 5% 0603; CLASS: DISCRETE; FPLIST: RC0603_OV,RC0603,0603_CC; CAD_APPROVED: Yes; MFG_PN01: RK73B1JTTD103J; MFG_NAME01: KOA SPEER; AGILE_PN: 470-75410; HEIGHT: 0.55MM; ROHS: Yes; Tolerance: 5%
TP45 TP47 = TestLoop: as TP24 on sheet 04; MFG_PN01: NOTACOMPONENT; ROHS: Yes; HEIGHT: 0.1MM
TP46 = TEST_POINT: as GND2 on sheet 04; ROHS: Yes; HEIGHT: 1.53 MM

## Sheet 02.SchDoc
size 386 x 246 mm
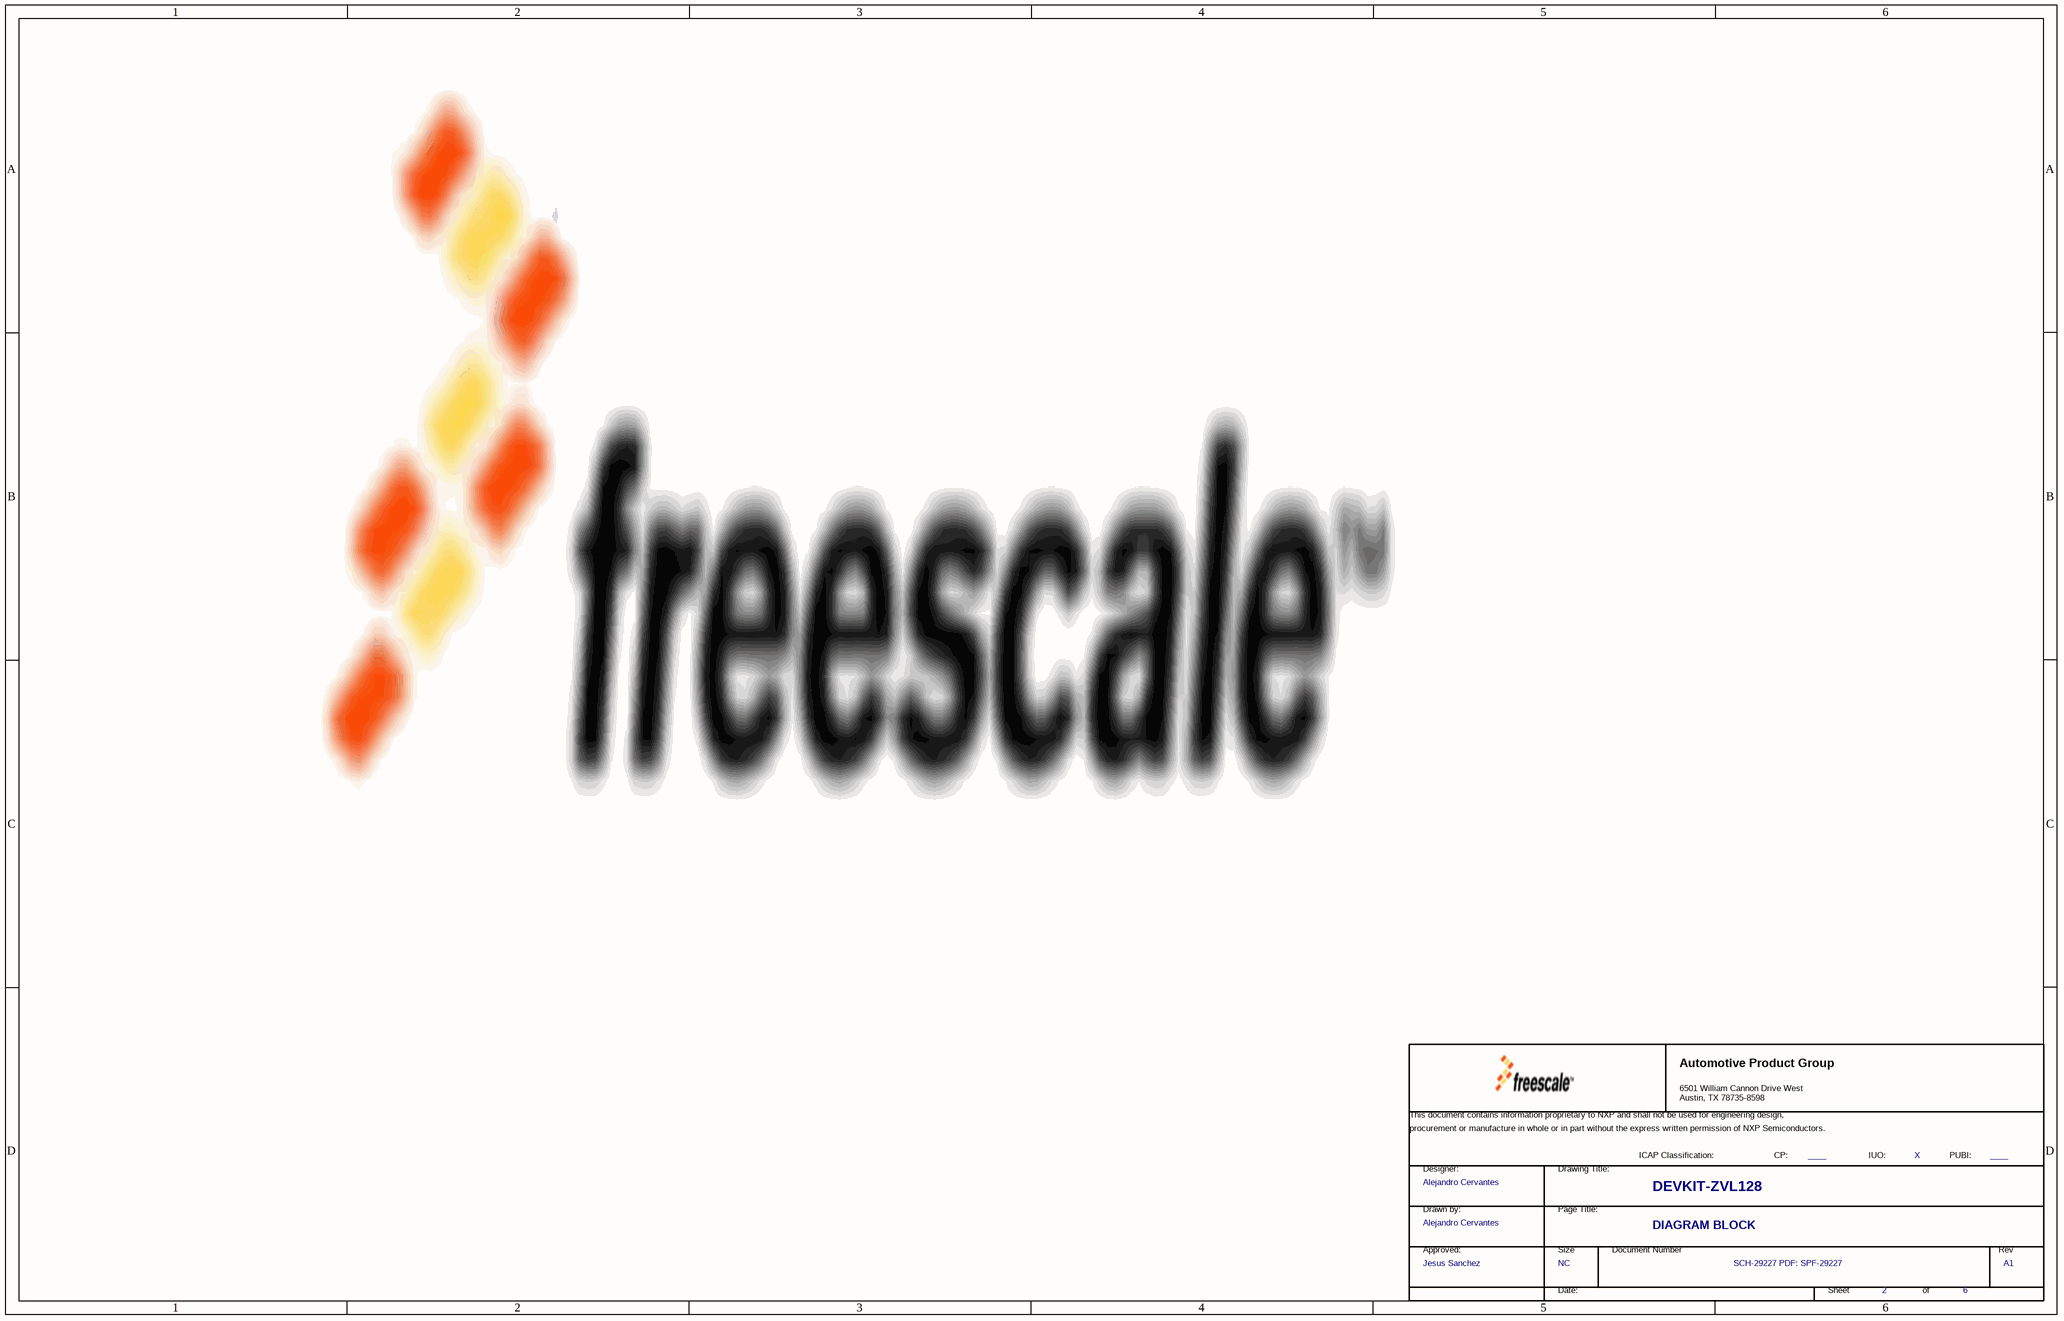
[diagram p8: 02.SchDoc]

### Parts
(Parts that share a designator on the sheet are numbered #1, #2 ... from top to bottom, then left to right.)
*#5  FCP: ____  FIUO: X  DrawnBy: Alejandro Cervantes  Approver: Jesus Sanchez  PageTitle: DIAGRAM BLOCK  Page Count: 6  Page Number: 2  Page Size: NC  Title: DEVKIT-ZVL128  RevCode: A1  Doc: SCH-29227 PDF: SPF-29227  (hidden comment: TitleBlock_AMPG)  (graphical)

### Notes on the sheet
- (in symbol TitleBlock_AMPG) Automotive Product Group; 6501 William Cannon Drive West / Austin, TX 78735-8598; This document contains information proprietary to NXP and shall not be used for engineering design,; procurement or manufacture in whole or in part without the express written permission of NXP Semiconductors.; ICAP Classification:; CP:; IUO:; PUBI:; Designer:; Drawing Title:; Drawn by:; Page Title:; Approved:; Size; Document Number; Rev; Date:; Sheet; of

### Library data of the parts
*#5 = TitleBlock_AMPG: as *#2 on sheet 05; PUBI: ____; Designer: Alejandro Cervantes; Page Create Date: March  8, 1995